# Altium project DIOT_Template.PrjPCB (part 2 of 3)

## Sheet DIOT_signal_routing.SchDoc: =DocumentName
size A4; DocumentNumber: 1; Revision: 0; SheetNumber: 9; SheetTotal: 18
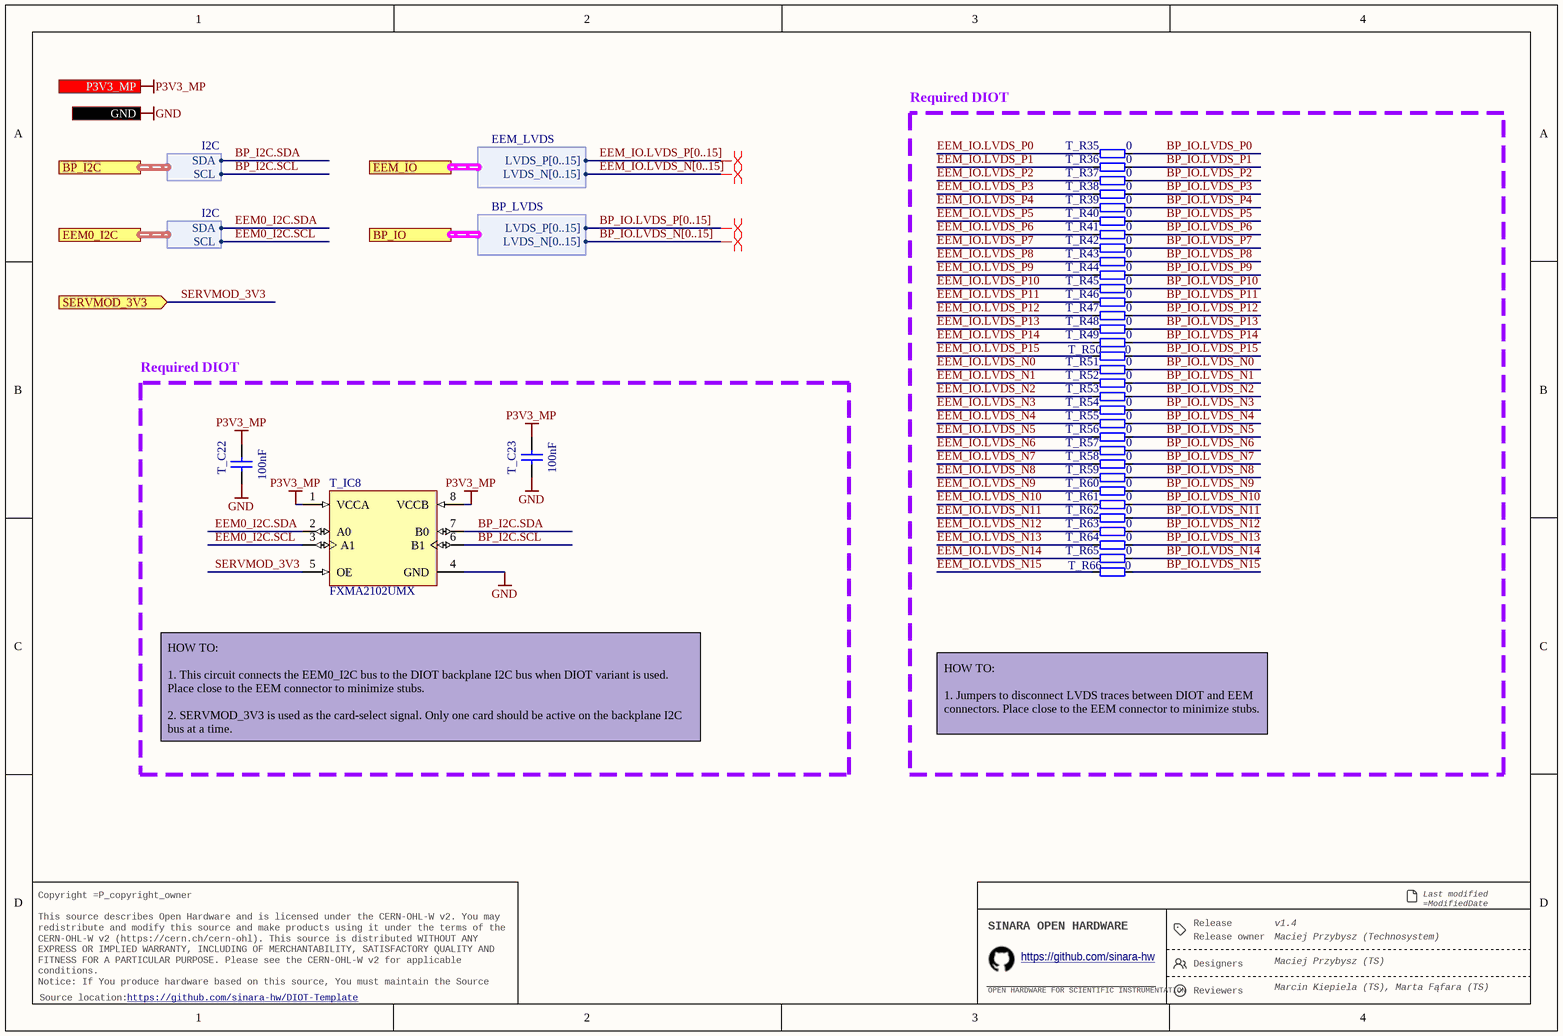
[diagram p6: DIOT_signal_routing.SchDoc]

### Parts
T_C22  100nF  [CAPC1005X55N]
T_C23  100nF  [CAPC1005X55N]
T_IC8  FXMA2102UMX  [FXMA2102UMX]
T_R35  0  [RESC1005X40N]
T_R36  0  [RESC1005X40N]
T_R37  0  [RESC1005X40N]
T_R38  0  [RESC1005X40N]
T_R39  0  [RESC1005X40N]
T_R40  0  [RESC1005X40N]
T_R41  0  [RESC1005X40N]
T_R42  0  [RESC1005X40N]
T_R43  0  [RESC1005X40N]
T_R44  0  [RESC1005X40N]
T_R45  0  [RESC1005X40N]
T_R46  0  [RESC1005X40N]
T_R47  0  [RESC1005X40N]
T_R48  0  [RESC1005X40N]
T_R49  0  [RESC1005X40N]
T_R50  0  [RESC1005X40N]
T_R51  0  [RESC1005X40N]
T_R52  0  [RESC1005X40N]
T_R53  0  [RESC1005X40N]
T_R54  0  [RESC1005X40N]
T_R55  0  [RESC1005X40N]
T_R56  0  [RESC1005X40N]
T_R57  0  [RESC1005X40N]
T_R58  0  [RESC1005X40N]
T_R59  0  [RESC1005X40N]
T_R60  0  [RESC1005X40N]
T_R61  0  [RESC1005X40N]
T_R62  0  [RESC1005X40N]
T_R63  0  [RESC1005X40N]
T_R64  0  [RESC1005X40N]
T_R65  0  [RESC1005X40N]
T_R66  0  [RESC1005X40N]

### Blocks framed on the sheet
Required DIOT: T_R35-T_R66
Required DIOT: T_C22 T_C23 T_IC8

### Ports
BP_I2C (harness I2C), BP_IO (harness BP_LVDS), EEM0_I2C (harness I2C), EEM_IO (harness EEM_LVDS), GND, P3V3_MP (in), SERVMOD_3V3 (in)

### Harnesses
I2C: SDA, SCL
EEM_LVDS: LVDS_P[0..15], LVDS_N[0..15]
BP_LVDS: LVDS_P[0..15], LVDS_N[0..15]

### Nets
GND: T_C22.1 T_C23.1 T_IC8.4(GND) ; port GND
P3V3_MP: T_C22.2 T_C23.2 T_IC8.1(VCCA) T_IC8.8(VCCB) ; port P3V3_MP
BP_I2C.SCL: T_IC8.6(B1) ; port BP_I2C.SCL
BP_I2C.SDA: T_IC8.7(B0) ; port BP_I2C.SDA
BP_IO.LVDS_N0: T_R51.1
BP_IO.LVDS_N1: T_R52.1
BP_IO.LVDS_N2: T_R53.1
BP_IO.LVDS_N3: T_R54.1
BP_IO.LVDS_N4: T_R55.1
BP_IO.LVDS_N5: T_R56.1
BP_IO.LVDS_N6: T_R57.1
BP_IO.LVDS_N7: T_R58.1
BP_IO.LVDS_N8: T_R59.1
BP_IO.LVDS_N9: T_R60.1
BP_IO.LVDS_N10: T_R61.1
BP_IO.LVDS_N11: T_R62.1
BP_IO.LVDS_N12: T_R63.1
BP_IO.LVDS_N13: T_R64.1
BP_IO.LVDS_N14: T_R65.1
BP_IO.LVDS_N15: T_R66.2
BP_IO.LVDS_P0: T_R35.1
BP_IO.LVDS_P1: T_R36.1
BP_IO.LVDS_P2: T_R37.1
BP_IO.LVDS_P3: T_R38.1
BP_IO.LVDS_P4: T_R39.1
BP_IO.LVDS_P5: T_R40.1
BP_IO.LVDS_P6: T_R41.1
BP_IO.LVDS_P7: T_R42.1
BP_IO.LVDS_P8: T_R43.1
BP_IO.LVDS_P9: T_R44.1
BP_IO.LVDS_P10: T_R45.1
BP_IO.LVDS_P11: T_R46.1
BP_IO.LVDS_P12: T_R47.1
BP_IO.LVDS_P13: T_R48.1
BP_IO.LVDS_P14: T_R49.1
BP_IO.LVDS_P15: T_R50.2
EEM0_I2C.SCL: T_IC8.3(A1) ; port EEM0_I2C.SCL
EEM0_I2C.SDA: T_IC8.2(A0) ; port EEM0_I2C.SDA
EEM_IO.LVDS_N0: T_R51.2
EEM_IO.LVDS_N1: T_R52.2
EEM_IO.LVDS_N2: T_R53.2
EEM_IO.LVDS_N3: T_R54.2
EEM_IO.LVDS_N4: T_R55.2
EEM_IO.LVDS_N5: T_R56.2
EEM_IO.LVDS_N6: T_R57.2
EEM_IO.LVDS_N7: T_R58.2
EEM_IO.LVDS_N8: T_R59.2
EEM_IO.LVDS_N9: T_R60.2
EEM_IO.LVDS_N10: T_R61.2
EEM_IO.LVDS_N11: T_R62.2
EEM_IO.LVDS_N12: T_R63.2
EEM_IO.LVDS_N13: T_R64.2
EEM_IO.LVDS_N14: T_R65.2
EEM_IO.LVDS_N15: T_R66.1
EEM_IO.LVDS_P0: T_R35.2
EEM_IO.LVDS_P1: T_R36.2
EEM_IO.LVDS_P2: T_R37.2
EEM_IO.LVDS_P3: T_R38.2
EEM_IO.LVDS_P4: T_R39.2
EEM_IO.LVDS_P5: T_R40.2
EEM_IO.LVDS_P6: T_R41.2
EEM_IO.LVDS_P7: T_R42.2
EEM_IO.LVDS_P8: T_R43.2
EEM_IO.LVDS_P9: T_R44.2
EEM_IO.LVDS_P10: T_R45.2
EEM_IO.LVDS_P11: T_R46.2
EEM_IO.LVDS_P12: T_R47.2
EEM_IO.LVDS_P13: T_R48.2
EEM_IO.LVDS_P14: T_R49.2
EEM_IO.LVDS_P15: T_R50.1
SERVMOD_3V3: T_IC8.5(OE) ; port SERVMOD_3V3

### Buses and harness runs
bus BP_IO.LVDS_N[0..15]
bus BP_IO.LVDS_P[0..15]
bus EEM_IO.LVDS_N[0..15]
bus EEM_IO.LVDS_P[0..15]

### Layout directives
differential pair; differential pair class Diff_100Ohm: (no net found under the mark)
differential pair: (no net found under the mark)

### Notes on the sheet
- HOW TO:
  1. This circuit connects the EEM0_I2C bus to the DIOT backplane I2C bus when DIOT variant is used. Place close to the EEM connector to minimize stubs.
  2. SERVMOD_3V3 is used as the card-select signal. Only one card should be active on the backplane I2C bus at a time.
- HOW TO:
  1. Jumpers to disconnect LVDS traces between DIOT and EEM connectors. Place close to the EEM connector to minimize stubs.
- Release
- Last modified =ModifiedDate
  Sheet =sheetnumber of =sheettotal · Size A4
- Copyright =P_copyright_owner
  This source describes Open Hardware and is licensed under the CERN-OHL-W v2. You may redistribute and modify this source and make products using it under the terms of the CERN-OHL-W v2 (https://cern.ch/cern-ohl). This source is distributed WITHOUT ANY EXPRESS OR IMPLIED WARRANTY, INCLUDING OF MERCHANTABILITY, SATISFACTORY QUALITY AND FITNESS FOR A PARTICULAR PURPOSE. Please see the CERN-OHL-W v2 for applicable conditions.
  Notice: If You produce hardware based on this source, You must maintain the Source Location visible on the product, its packaging or its documentation.
- SINARA OPEN HARDWARE
- OPEN HARDWARE FOR SCIENTIFIC INSTRUMENTATION
- https://github.com/sinara-hw
- Release owner
- Designers
- Reviewers
- Source location:

### Library data of the parts
T_C22 T_C23 = CC0402_100NF_50V_10%_X7R: as T_C14 on sheet Power-up_delay; Part Number: CC0402_100NF_50V_10%_X7R; Component Kind: Standard; Component Type: Standard; Pin Count: 2; Value: 100nF; Status: None; Manufacturer Part Number: CC0402_100NF_50V_10%_X7R; Case: 0402; Mounted: Yes; Socket: No; SMD: Yes; Manufacturer1 Example: MURATA; Manufacturer1 ComponentHeight: 0.55mm; HelpURL: \\cern.ch\dfs\Applications\Altium\Datasheets\CC0402_MURATA_GRM155R71H104KE14D.pdf; Author: CERN DEM MR; CreateDate: 30.06.2017; LatestRevisionDate: 30.06.2017; Sense: No
T_IC8 = CMP-015-00014-1: Dual Supply 2-Bit Voltage Translator/Buffer/Repeater Isolator for I2C Applications; Manufacturer: Onsemi; Max Supply Voltage: 5.5V; Min Supply Voltage: 1.65V; Min Operating Temperature: -40°C; Pins: 8; Max Operating Temperature: 85°C; Manufacaturer Part Number: FXMA2102UMX; Mounting Technology: Surface Mount
T_R35-T_R66 = R0402_0R_JUMPER: Resistor; Part Description: 1A (0.05R Max DC Resistance) Zero Ohm Jumper; Manufacturer: GENERIC; Manufacturer1 Part Number: 232270591001L; PressFit: No; Part Number: R0402_0R_JUMPER; Component Kind: Standard; Component Type: Standard; Pin Count: 2; Value: 0; Status: Not Recommended; Manufacturer Part Number: R0402_0R_JUMPER; Case: 0402; Mounted: Yes; Sense: No; Socket: No; SMD: Yes; Manufacturer1 Example: YAGEO PHYCOMP; Manufacturer1 ComponentHeight: 0.4mm; HelpURL: \\cern.ch\dfs\Applications\Altium\Datasheets\R0402_Phycomp_RC0402.pdf; Author: CERN DEM JLC; CreateDate: 03.12.2007; LatestRevisionDate: 17.10.2012

## Sheet EEM_Connectors.SchDoc: =DocumentName
size A4; SPICEModelCacheVGBTAUBO: <root> / <DocumentId>VGBTAUBO</DocumentId> / </root>; DocumentNumber: 1; Revision: 0; SheetNumber: 6; SheetTotal: 18
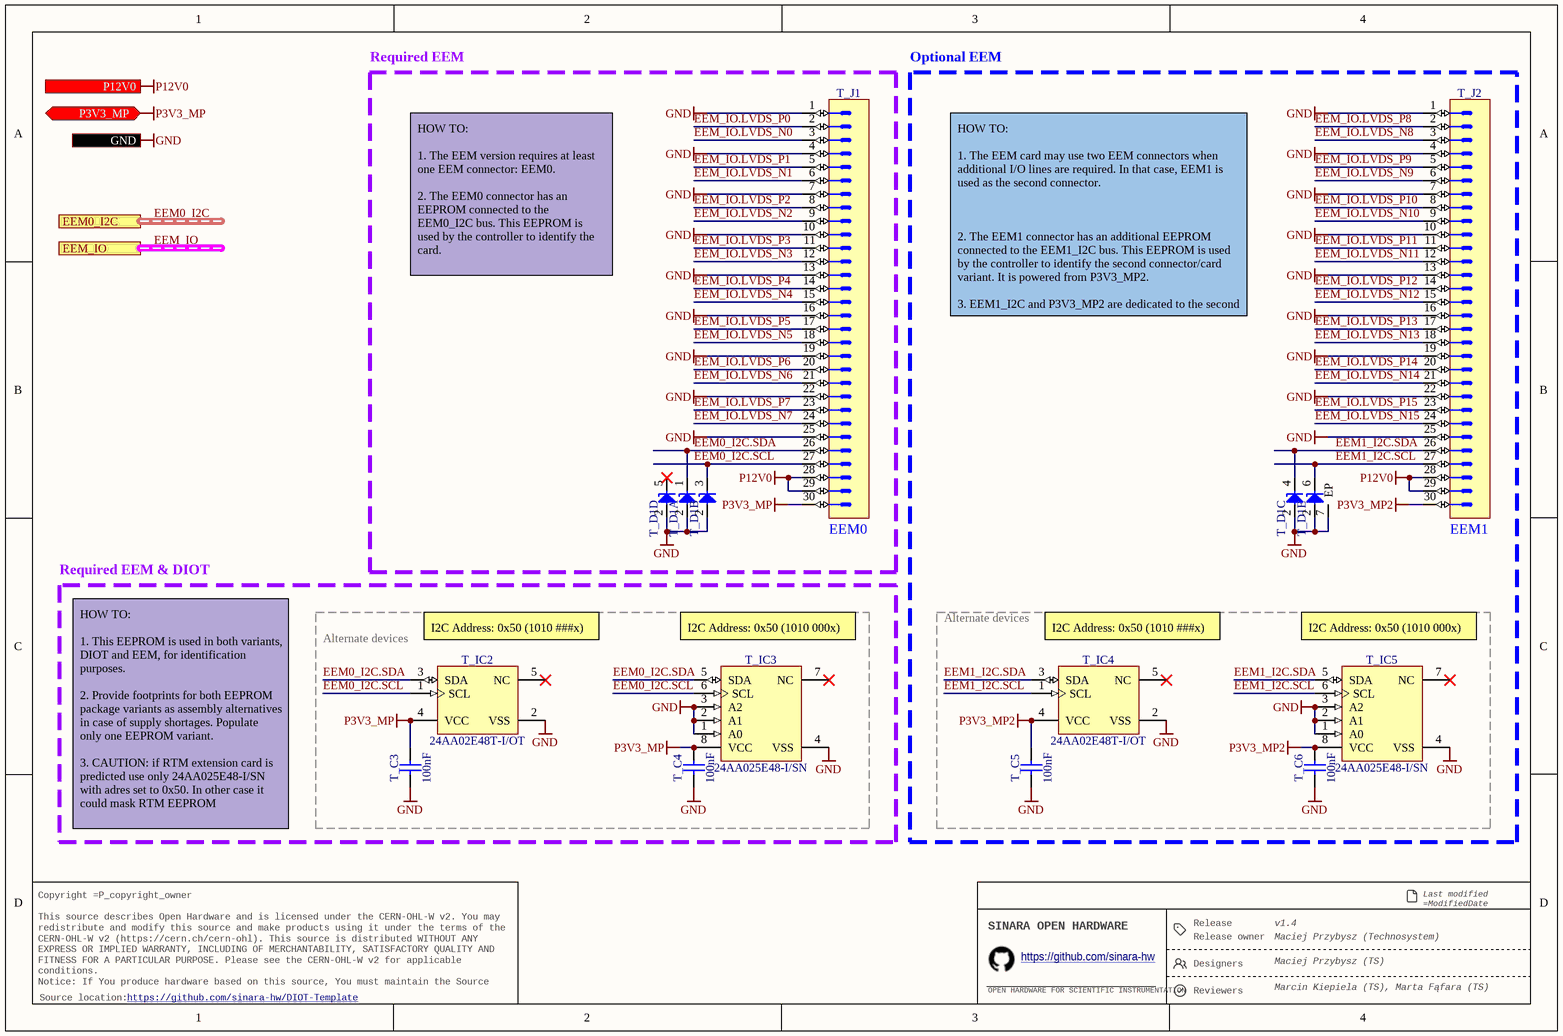
[diagram p7: EEM_Connectors.SchDoc]

### Parts
T_C3  100nF  [CAPC1005X55N]
T_C4  100nF  [CAPC1005X55N]
T_C5  100nF  [CAPC1005X55N]
T_C6  100nF  [CAPC1005X55N]
T_D1  UCLAMP3305P.TCT  [SON50P160X65_HS-7N]  (value not drawn)  (parts A,B,C,D,E of 5)
T_IC2  24AA02E48T-I/OT  [SOT95P280X145-5N]
T_IC3  24AA025E48-I/SN  [SOIC127P600X175-8N]
T_IC4  24AA02E48T-I/OT  [SOT95P280X145-5N]
T_IC5  24AA025E48-I/SN  [SOIC127P600X175-8N]
T_J1  (no value)  [3M_N2530-6002RB]
T_J2  (no value)  [3M_N2530-6002RB]

### Blocks framed on the sheet
Alternate devices: T_C3 T_C4 T_IC2 T_IC3
Alternate devices: T_C5 T_C6 T_IC4 T_IC5

### Ports
EEM0_I2C (harness I2C), EEM_IO (harness EEM_LVDS), GND, P3V3_MP (bidir), P12V0 (out)

### Nets
GND: T_C3.1 T_C4.1 T_C5.1 T_C6.1 T_D1.2(A) T_D1.7(EP) T_IC2.2(VSS) T_IC3.1(A0) T_IC3.2(A1) T_IC3.3(A2) T_IC3.4(VSS) T_IC4.2(VSS) T_IC5.1(A0) T_IC5.2(A1) T_IC5.3(A2) T_IC5.4(VSS) T_J1.1 T_J1.4 T_J1.7 T_J1.10 T_J1.13 T_J1.16 T_J1.19 T_J1.22 T_J1.25 T_J2.1 T_J2.4 T_J2.7 T_J2.10 T_J2.13 T_J2.16 T_J2.19 T_J2.22 T_J2.25 ; port GND
P3V3_MP: T_C3.2 T_C4.2 T_IC2.4(VCC) T_IC3.8(VCC) T_J1.30 ; port P3V3_MP
P3V3_MP2: T_C5.2 T_C6.2 T_IC4.4(VCC) T_IC5.8(VCC) T_J2.30
P12V0: T_J1.28 T_J1.29 T_J2.28 T_J2.29 ; port P12V0
EEM0_I2C.SCL: T_D1.3(C) T_IC2.1(SCL) T_IC3.6(SCL) T_J1.27
EEM0_I2C.SDA: T_D1.1(C) T_IC2.3(SDA) T_IC3.5(SDA) T_J1.26
EEM1_I2C.SCL: T_D1.6(C) T_IC4.1(SCL) T_IC5.6(SCL) T_J2.27
EEM1_I2C.SDA: T_D1.4(C) T_IC4.3(SDA) T_IC5.5(SDA) T_J2.26
EEM_IO.LVDS_N0: T_J1.3
EEM_IO.LVDS_N1: T_J1.6
EEM_IO.LVDS_N2: T_J1.9
EEM_IO.LVDS_N3: T_J1.12
EEM_IO.LVDS_N4: T_J1.15
EEM_IO.LVDS_N5: T_J1.18
EEM_IO.LVDS_N6: T_J1.21
EEM_IO.LVDS_N7: T_J1.24
EEM_IO.LVDS_N8: T_J2.3
EEM_IO.LVDS_N9: T_J2.6
EEM_IO.LVDS_N10: T_J2.9
EEM_IO.LVDS_N11: T_J2.12
EEM_IO.LVDS_N12: T_J2.15
EEM_IO.LVDS_N13: T_J2.18
EEM_IO.LVDS_N14: T_J2.21
EEM_IO.LVDS_N15: T_J2.24
EEM_IO.LVDS_P0: T_J1.2
EEM_IO.LVDS_P1: T_J1.5
EEM_IO.LVDS_P2: T_J1.8
EEM_IO.LVDS_P3: T_J1.11
EEM_IO.LVDS_P4: T_J1.14
EEM_IO.LVDS_P5: T_J1.17
EEM_IO.LVDS_P6: T_J1.20
EEM_IO.LVDS_P7: T_J1.23
EEM_IO.LVDS_P8: T_J2.2
EEM_IO.LVDS_P9: T_J2.5
EEM_IO.LVDS_P10: T_J2.8
EEM_IO.LVDS_P11: T_J2.11
EEM_IO.LVDS_P12: T_J2.14
EEM_IO.LVDS_P13: T_J2.17
EEM_IO.LVDS_P14: T_J2.20
EEM_IO.LVDS_P15: T_J2.23

Not connected (* = marked no-connect by the designer): T_D1 5(C)*; T_IC2 5(NC)*; T_IC3 7(NC)*; T_IC4 5(NC)*; T_IC5 7(NC)*

### Buses and harness runs
harness EEM0_I2C = port EEM0_I2C
harness EEM_IO = port EEM_IO

### Notes on the sheet
- Required EEM
- Optional EEM
- HOW TO:
  1. The EEM version requires at least one EEM connector: EEM0.
  2. The EEM0 connector has an EEPROM connected to the EEM0_I2C bus. This EEPROM is used by the controller to identify the card.
- HOW TO:
  1. The EEM card may use two EEM connectors when additional I/O lines are required. In that case, EEM1 is used as the second connector.
  2. The EEM1 connector has an additional EEPROM connected to the EEM1_I2C bus. This EEPROM is used by the controller to identify the second connector/card variant. It is powered from P3V3_MP2.
  3. EEM1_I2C and P3V3_MP2 are dedicated to the second EEPROM only. Do not use them for any other purpose.
- Required EEM & DIOT
- (near T_J1) EEM0
- (near T_J2) EEM1
- (near T_IC2) I2C Address: 0x50 (1010 ###x)
- (near T_IC3) I2C Address: 0x50 (1010 000x)
- (near T_IC4) I2C Address: 0x50 (1010 ###x)
- (near T_IC5) I2C Address: 0x50 (1010 000x)
- HOW TO:
  1. This EEPROM is used in both variants, DIOT and EEM, for identification purposes.
  2. Provide footprints for both EEPROM package variants as assembly alternatives in case of supply shortages. Populate only one EEPROM variant.
  3. CAUTION: if RTM extension card is predicted use only 24AA025E48-I/SN with adres set to 0x50. In other case it could mask RTM EEPROM
- Release
- Last modified =ModifiedDate
  Sheet =sheetnumber of =sheettotal · Size A4
- Copyright =P_copyright_owner
  This source describes Open Hardware and is licensed under the CERN-OHL-W v2. You may redistribute and modify this source and make products using it under the terms of the CERN-OHL-W v2 (https://cern.ch/cern-ohl). This source is distributed WITHOUT ANY EXPRESS OR IMPLIED WARRANTY, INCLUDING OF MERCHANTABILITY, SATISFACTORY QUALITY AND FITNESS FOR A PARTICULAR PURPOSE. Please see the CERN-OHL-W v2 for applicable conditions.
  Notice: If You produce hardware based on this source, You must maintain the Source Location visible on the product, its packaging or its documentation.
- SINARA OPEN HARDWARE
- OPEN HARDWARE FOR SCIENTIFIC INSTRUMENTATION
- https://github.com/sinara-hw
- Release owner
- Designers
- Reviewers
- Source location:

### Library data of the parts
T_C3-T_C6 = CC0402_100NF_50V_10%_X7R: as T_C14 on sheet Power-up_delay; Part Number: CC0402_100NF_50V_10%_X7R; Component Kind: Standard; Component Type: Standard; Pin Count: 2; Value: 100nF; Status: None; Manufacturer Part Number: CC0402_100NF_50V_10%_X7R; Case: 0402; Mounted: Yes; Socket: No; SMD: Yes; Sense: No; HelpURL: \\cern.ch\dfs\Applications\Altium\Datasheets\CC0402_MURATA_GRM155R71H104KE14D.pdf; Author: CERN DEM MR; CreateDate: 30.06.2017; LatestRevisionDate: 30.06.2017; Manufacturer1 Example: MURATA; Manufacturer1 ComponentHeight: 0.55mm
T_D1 = CMP-004-00037-2: Diode TVS Quint Common Anode Uni-Dir 3.3V 40W 6-Pin SLP EP T/R; Max Operating Temperature: 125°C; Min Operating Temperature: -55°C; Pins: 6; Mounting Technology: Surface Mount
T_IC2 T_IC4 = 24AA02E48T-I/OT: 1.7V-5.5V, 2K I2C Serial EEPROM With EUI-48 Node Identity; Manufacturer: MICROCHIP TECHNOLOGY; PressFit: No; Bonding: No; Part Number: 24AA02E48T-I/OT; Component Kind: Standard; Component Type: Standard; Device: 24AA02E48T-I/OT; PackageDescription: SOT, 0.95mm pitch; 5 pin, 1.60mm W X 2.90mm L X 1.45mm H body, IPC Medium Density; Part Description: 1.7V-5.5V, 2K I2C Serial EEPROM with EUI-48 Node Identity; Manufacturer Part Number: 24AA02E48T-I/OT; Pin Count: 5; Case: SOT23-5; Mounted: Yes; Socket: No; SMD: Yes; Sense: No; ComponentHeight: 1.45mm; HelpURL: \\cern.ch\dfs\Applications\Altium\Datasheets\24AA02E48T-I-OT.pdf; Author: CERN DEM MR; CreateDate: 31.03.2016; LatestRevisionDate: 31.03.2016
T_IC3 T_IC5 = 24AA025E48-I/SN: 1.7V-5.5V, 2K I2C™ Serial EEPROMs with EUI-48™ Node Identity; Manufacturer: MICROCHIP TECHNOLOGY; PressFit: No; Bonding: No; Part Number: 24AA025E48-I/SN; Component Kind: Standard; Component Type: Standard; Device: 24AA025E48-I/SN; PackageDescription: SOIC 8, Pitch 1.27mm - Body 4x5mm, IPC Medium Density; Part Description: 1.7V-5.5V, 2K I2C™ Serial EEPROMs with EUI-48™ Node Identity; Manufacturer Part Number: 24AA025E48-I/SN; Pin Count: 8; Case: SOIC8; Mounted: Yes; Socket: No; SMD: Yes; Sense: No; ComponentHeight: 1.75mm; HelpURL: \\cern.ch\dfs\Applications\Altium\Datasheets\24AA025E48-I-SN.pdf; Author: CERN DEM MR; CreateDate: 19.07.2016; LatestRevisionDate: 19.07.2016
T_J1 T_J2 = 3M_N2530-6002RB: Connector 30 Male; Part Description: 30 Contacts - Straight .100'' x .100'' Low Profile Four-Wall Header, 2500 Series; Manufacturer: 3M; PressFit: No; Part Number: 3M_N2530-6002RB; Component Kind: Standard; Component Type: Standard; Pin Count: 30; Family: Header 30; Mounted: Yes; Socket: No; SMD: No; Sense: No; Status: None; Manufacturer Part Number: N2530-6002RB; ComponentHeight: 10.03mm; HelpURL: \\cern.ch\dfs\Applications\Altium\Datasheets\3M_N2530-6002RB.pdf; Author: CERN DEM JLC; CreateDate: 11.02.2009; LatestRevisionDate: 11.08.2009

## Sheet CLK_GEN.SchDoc: =DocumentName
size A4; DocumentNumber: 1; Revision: 0; SheetNumber: 7; SheetTotal: 18
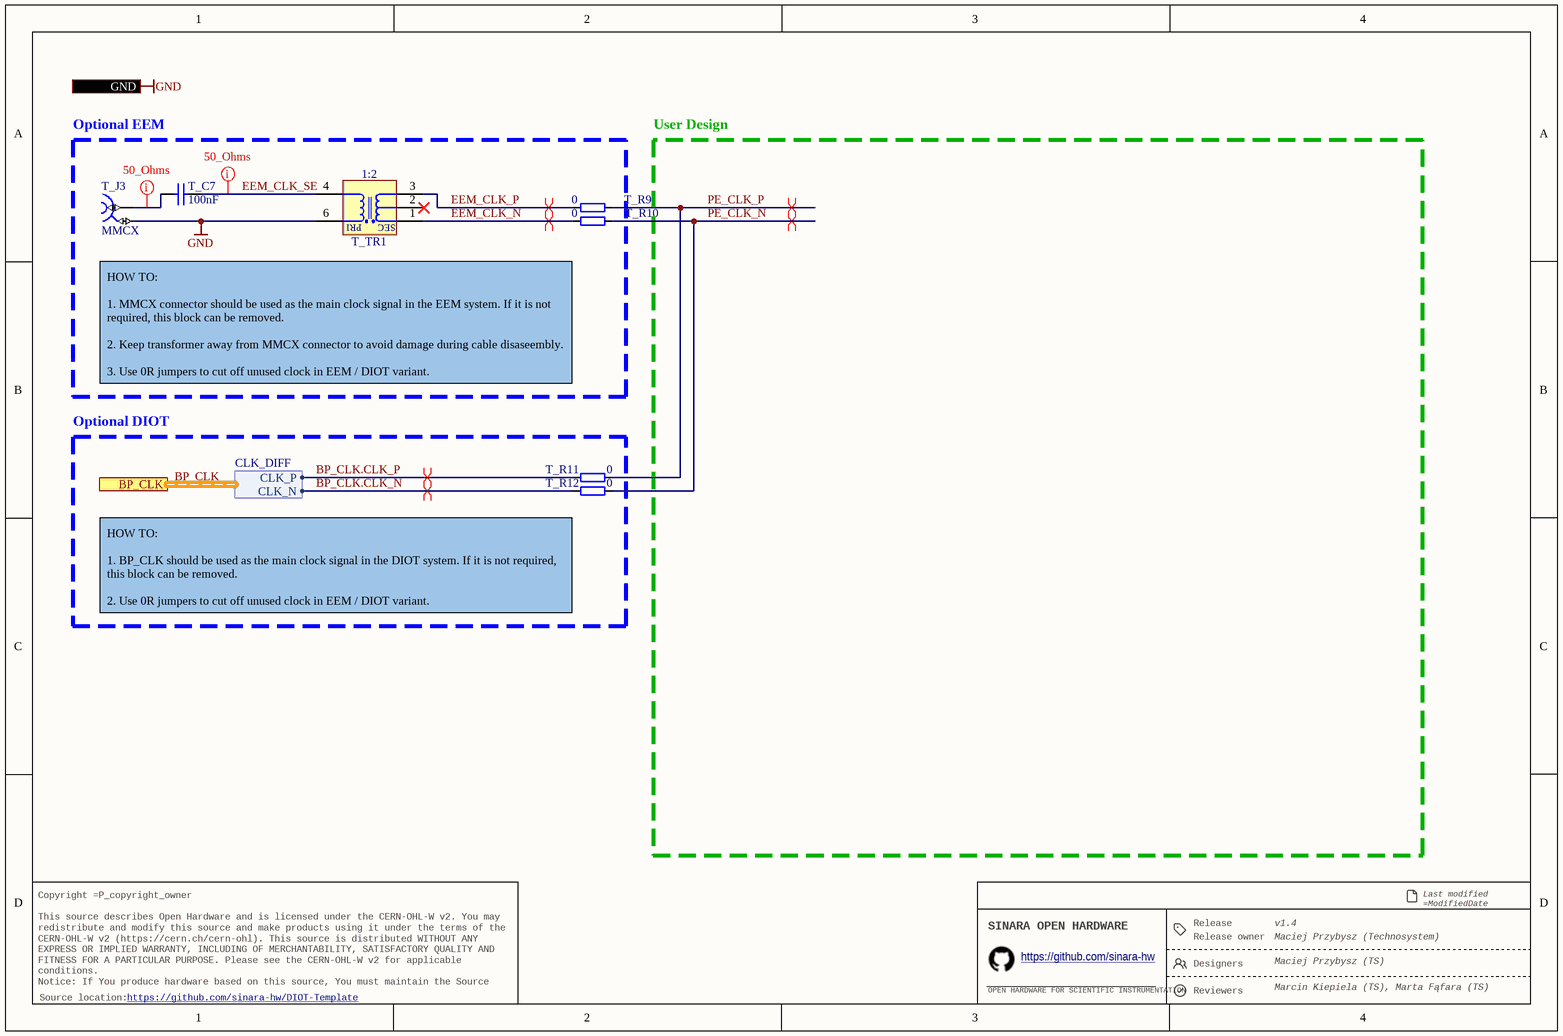
[diagram p8: CLK_GEN.SchDoc]

### Parts
T_C7  100nF  [CAPC1005X55N]
T_J3  MMCX  [SAMTEC_MMCX-J-P-H-ST-TH1]
T_R9  0  [RESC1005X40N]
T_R10  0  [RESC1005X40N]
T_R11  0  [RESC1005X40N]
T_R12  0  [RESC1005X40N]
T_TR1  1:2  [XFMR_MINI-CIRCUITS_DB714]

### Blocks framed on the sheet
Optional EEM: T_C7 T_J3 T_R9 T_R10 T_TR1
Optional DIOT: T_R11 T_R12

### Ports
BP_CLK (harness CLK_DIFF), GND

### Harnesses
CLK_DIFF: CLK_N, CLK_P

### Nets
GND: T_J3.2 T_TR1.6(PDOT) ; port GND
BP_CLK.CLK_N: T_R12.1 ; port BP_CLK.CLK_N
BP_CLK.CLK_P: T_R11.1 ; port BP_CLK.CLK_P
EEM_CLK_N: T_R10.2 T_TR1.1(SDOT)
EEM_CLK_P: T_R9.2 T_TR1.3(S)
EEM_CLK_SE: T_C7.1 T_TR1.4(P)
PE_CLK_N: T_R10.1 T_R12.2
PE_CLK_P: T_R9.1 T_R11.2
NetT_C7_2: T_C7.2 T_J3.1

Not connected (* = marked no-connect by the designer): T_TR1 2(NU)*

### Buses and harness runs
harness BP_CLK = port BP_CLK

### Layout directives
differential pair; differential pair class Diff_100Ohm: PE_CLK_N, PE_CLK_P
net class 50Ohm: EEM_CLK_SE, NetT_C7_2
differential pair: BP_CLK.CLK_N, BP_CLK.CLK_P, EEM_CLK_N, EEM_CLK_P

### Notes on the sheet
- User Design
- HOW TO:
  1. MMCX connector should be used as the main clock signal in the EEM system. If it is not required, this block can be removed.
  2. Keep transformer away from MMCX connector to avoid damage during cable disaseembly.
  3. Use 0R jumpers to cut off unused clock in EEM / DIOT variant.
- HOW TO:
  1. BP_CLK should be used as the main clock signal in the DIOT system. If it is not required, this block can be removed.
  2. Use 0R jumpers to cut off unused clock in EEM / DIOT variant.
- Release
- Last modified =ModifiedDate
  Sheet =sheetnumber of =sheettotal · Size A4
- Copyright =P_copyright_owner
  This source describes Open Hardware and is licensed under the CERN-OHL-W v2. You may redistribute and modify this source and make products using it under the terms of the CERN-OHL-W v2 (https://cern.ch/cern-ohl). This source is distributed WITHOUT ANY EXPRESS OR IMPLIED WARRANTY, INCLUDING OF MERCHANTABILITY, SATISFACTORY QUALITY AND FITNESS FOR A PARTICULAR PURPOSE. Please see the CERN-OHL-W v2 for applicable conditions.
  Notice: If You produce hardware based on this source, You must maintain the Source Location visible on the product, its packaging or its documentation.
- SINARA OPEN HARDWARE
- OPEN HARDWARE FOR SCIENTIFIC INSTRUMENTATION
- https://github.com/sinara-hw
- Release owner
- Designers
- Reviewers
- Source location:

### Library data of the parts
T_C7 = CC0402_100NF_50V_10%_X7R: as T_C14 on sheet Power-up_delay; Part Number: CC0402_100NF_50V_10%_X7R; Component Kind: Standard; Component Type: Standard; Pin Count: 2; Value: 100nF; Status: None; Manufacturer Part Number: CC0402_100NF_50V_10%_X7R; Case: 0402; Mounted: Yes; Socket: No; SMD: Yes; Sense: No; Manufacturer1 Example: MURATA; Manufacturer1 ComponentHeight: 0.55mm; HelpURL: \\cern.ch\dfs\Applications\Altium\Datasheets\CC0402_MURATA_GRM155R71H104KE14D.pdf; Author: CERN DEM MR; CreateDate: 30.06.2017; LatestRevisionDate: 30.06.2017
T_J3 = SAMTEC_MMCX-J-P-H-ST-TH1: Part Description: Straight Through-hole 50 Ohm Micro Mini RF Jack, MMCX Series; Manufacturer: SAMTEC; PressFit: No; Part Number: SAMTEC_MMCX-J-P-H-ST-TH1; Component Kind: Standard; Component Type: Standard; Pin Count: 2; Mounted: Yes; Socket: No; Sense: No; SMD: No; Status: None; Manufacturer Part Number: MMCX-J-P-H-ST-TH1; ComponentHeight: 4.35mm; HelpURL: \\cern.ch\dfs\Applications\Altium\Datasheets\SAMTEC_MMCX-J-P-H-ST-TH1.pdf; Author: CERN DEM JLC; CreateDate: 05.12.2012; LatestRevisionDate: 05.12.2012
T_R9-T_R12 = R0402_0R_JUMPER: as T_R35 on sheet DIOT_signal_routing; Part Number: R0402_0R_JUMPER; Component Kind: Standard; Component Type: Standard; Pin Count: 2; Value: 0; Status: Not Recommended; Manufacturer Part Number: R0402_0R_JUMPER; Case: 0402; Mounted: Yes; Sense: No; Socket: No; SMD: Yes; Manufacturer1 Example: YAGEO PHYCOMP; Manufacturer1 ComponentHeight: 0.4mm; HelpURL: \\cern.ch\dfs\Applications\Altium\Datasheets\R0402_Phycomp_RC0402.pdf; Author: CERN DEM JLC; CreateDate: 03.12.2007; LatestRevisionDate: 17.10.2012
T_TR1 = XFMR_MINI-CIRCUITS_TCM2-1T: 50 Ohms 3 to 300MHz RF Transformer; Power: 0.25W; Part Number: XFMR_MINI-CIRCUITS_TCM2-1T; Component Kind: Standard; Component Type: Standard; Pin Count: 6; Value: 1:2; Status: None; Part Description: 50 Ohms 3 to 300MHz RF Transformer; Manufacturer: MINI-CIRCUITS; Manufacturer Part Number: TCM2-1T; Mounted: Yes; Socket: No; Sense: No; SMD: Yes; ComponentHeight: 4.06mm; HelpURL: \\cern.ch\dfs\Applications\Altium\Datasheets\XFMR_MINI-CIRCUITS_TCM2-1T.pdf; Author: CERN DEM HF; CreateDate: 30.05.2023; LatestRevisionDate: 30.05.2023

## Sheet Temperature_monitoring.SchDoc: =DocumentName
size A4; DocumentNumber: 1; Revision: 0; SheetNumber: 10; SheetTotal: 18
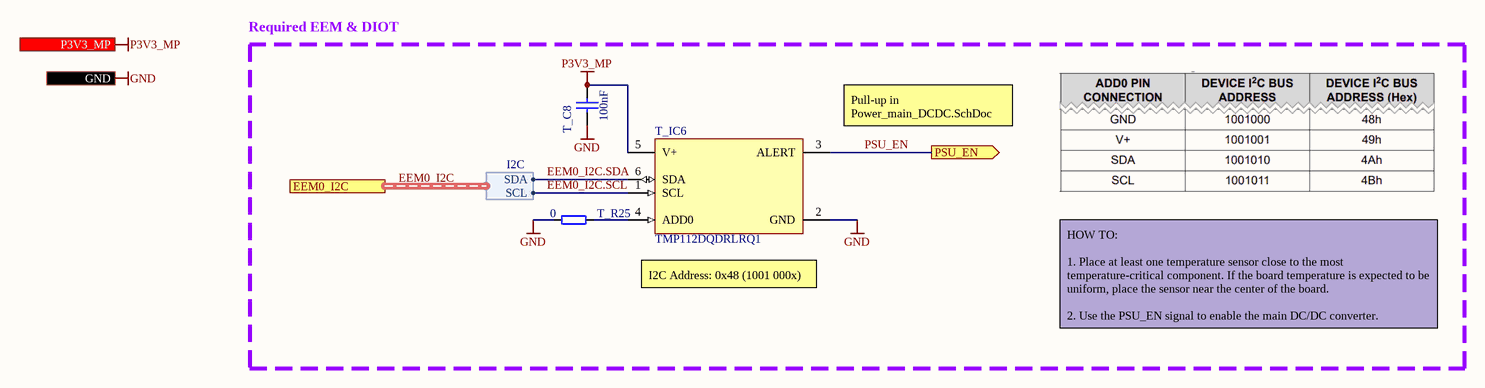
[diagram p9: Temperature_monitoring.SchDoc]

### Parts
T_C8  100nF  [CAPC1005X55N]
T_IC6  TMP112DQDRLRQ1  [SOTFL50P160X60-6N]
T_R25  0  [RESC1005X40N]

### Blocks framed on the sheet
Required EEM & DIOT: T_C8 T_IC6 T_R25

### Ports
EEM0_I2C (harness I2C), GND, P3V3_MP (in), PSU_EN (out)

### Harnesses
I2C: SDA, SCL

### Nets
GND: T_C8.1 T_IC6.2(GND) T_R25.1 ; port GND
P3V3_MP: T_C8.2 T_IC6.5(V+) ; port P3V3_MP
EEM0_I2C.SCL: T_IC6.1(SCL) ; port EEM0_I2C.SCL
EEM0_I2C.SDA: T_IC6.6(SDA) ; port EEM0_I2C.SDA
PSU_EN: T_IC6.3(ALERT) ; port PSU_EN
NetT_IC6_4: T_IC6.4(ADD0) T_R25.2

### Buses and harness runs
harness EEM0_I2C = port EEM0_I2C

### Notes on the sheet
- (near T_IC6) Pull-up in Power_main_DCDC.SchDoc
- (near T_IC6) I2C Address: 0x48 (1001 000x)
- HOW TO:
  1. Place at least one temperature sensor close to the most temperature-critical component. If the board temperature is expected to be uniform, place the sensor near the center of the board.
  2. Use the PSU_EN signal to enable the main DC/DC converter.
- Release
- Last modified =ModifiedDate
  Sheet =sheetnumber of =sheettotal · Size A4
- Copyright =P_copyright_owner
  This source describes Open Hardware and is licensed under the CERN-OHL-W v2. You may redistribute and modify this source and make products using it under the terms of the CERN-OHL-W v2 (https://cern.ch/cern-ohl). This source is distributed WITHOUT ANY EXPRESS OR IMPLIED WARRANTY, INCLUDING OF MERCHANTABILITY, SATISFACTORY QUALITY AND FITNESS FOR A PARTICULAR PURPOSE. Please see the CERN-OHL-W v2 for applicable conditions.
  Notice: If You produce hardware based on this source, You must maintain the Source Location visible on the product, its packaging or its documentation.
- SINARA OPEN HARDWARE
- OPEN HARDWARE FOR SCIENTIFIC INSTRUMENTATION
- https://github.com/sinara-hw
- Release owner
- Designers
- Reviewers
- Source location:

### Library data of the parts
T_C8 = CC0402_100NF_50V_10%_X7R: as T_C14 on sheet Power-up_delay; Part Number: CC0402_100NF_50V_10%_X7R; Component Kind: Standard; Component Type: Standard; Pin Count: 2; Value: 100nF; Status: None; Manufacturer Part Number: CC0402_100NF_50V_10%_X7R; Case: 0402; Mounted: Yes; Socket: No; SMD: Yes; Sense: No; Manufacturer1 Example: MURATA; Manufacturer1 ComponentHeight: 0.55mm; HelpURL: \\cern.ch\dfs\Applications\Altium\Datasheets\CC0402_MURATA_GRM155R71H104KE14D.pdf; Author: CERN DEM MR; CreateDate: 30.06.2017; LatestRevisionDate: 30.06.2017
T_IC6 = CMP-010-00651-1: Automotive, ±0.4°C accurate I²C temperature sensor with alert option 6-SOT-5X3 -40 to 125; Manufacturer: Texas Instruments; Pins: 6; Manufacturer Part Number: TMP112DQDRLRQ1
T_R25 = R0402_0R_JUMPER: Resistor; Part Description: 1A (0.05R Max DC Resistance) Zero Ohm Jumper; Manufacturer: GENERIC; Manufacturer1 Part Number: 232270591001L; Part Number: R0402_0R_JUMPER; Component Kind: Standard; Component Type: Standard; Pin Count: 2; Value: 0; Status: Not recommended; Manufacturer Part Number: R0402_0R_JUMPER; Case: 0402; Mounted: Yes; Sense: No; Socket: No; SMD: Yes; Manufacturer1 Example: YAGEO PHYCOMP; Manufacturer1 ComponentHeight: 0.4mm; HelpURL: \\cern.ch\dfs\Applications\Altium\Datasheets\R0402_Phycomp_RC0402.pdf; Author: CERN DEM JLC; CreateDate: 03.12.2007; LatestRevisionDate: 17.10.2012

## Sheet PWR_input_connector.SchDoc: =DocumentName
size A4; DocumentNumber: 1; Revision: 0; SheetNumber: 11; SheetTotal: 18
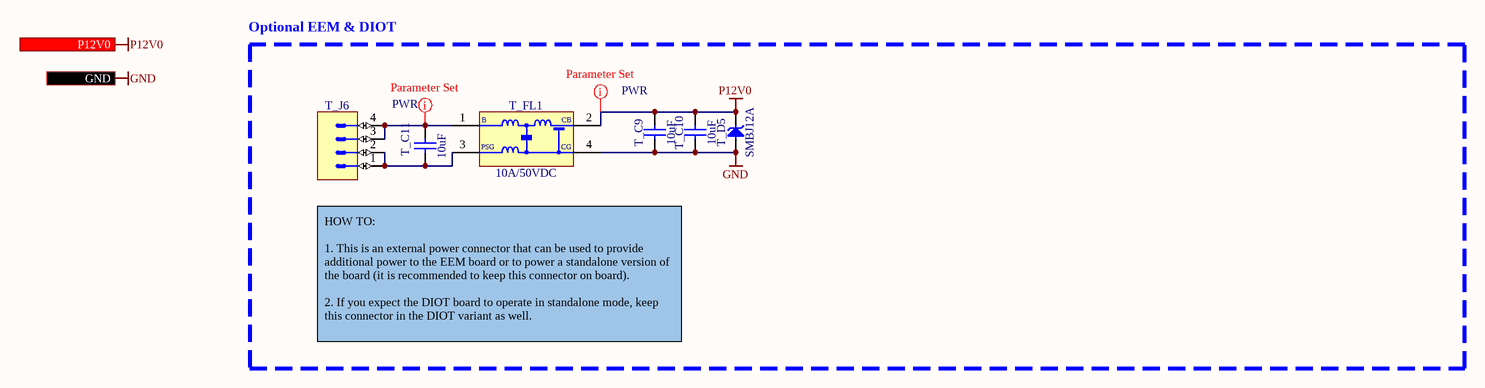
[diagram p10: PWR_input_connector.SchDoc]

### Parts
T_C9  10uF  [CAPC2012X95N]
T_C10  10uF  [CAPC2012X95N]
T_C11  10uF  [CAPC2012X95N]
T_D5  SMBJ12A  [DIOM5336X265N]
T_FL1  10A/50VDC  [FIL_MURATA_BNX02]
T_J6  Mini-Fit Jr.™  [MOLEX_39-30-0040]  (value not drawn)

### Blocks framed on the sheet
Optional EEM & DIOT: T_C9-T_C11 T_D5 T_FL1 T_J6

### Ports
GND, P12V0 (out)

### Nets
GND: T_C9.1 T_C10.1 T_D5.2(A) T_FL1.4(CG) ; port GND
P12V0: T_C9.2 T_C10.2 T_D5.1(C) T_FL1.2(CB) ; port P12V0
NetT_C11_1: T_C11.1 T_FL1.3(PSG) T_J6.1 T_J6.2
NetT_C11_2: T_C11.2 T_FL1.1(B) T_J6.3 T_J6.4

### Layout directives
net class PWR: NetT_C11_2, P12V0

### Notes on the sheet
- HOW TO:
  1. This is an external power connector that can be used to provide additional power to the EEM board or to power a standalone version of the board (it is recommended to keep this connector on board).
  2. If you expect the DIOT board to operate in standalone mode, keep this connector in the DIOT variant as well.
- Release
- Last modified =ModifiedDate
  Sheet =sheetnumber of =sheettotal · Size A4
- Copyright =P_copyright_owner
  This source describes Open Hardware and is licensed under the CERN-OHL-W v2. You may redistribute and modify this source and make products using it under the terms of the CERN-OHL-W v2 (https://cern.ch/cern-ohl). This source is distributed WITHOUT ANY EXPRESS OR IMPLIED WARRANTY, INCLUDING OF MERCHANTABILITY, SATISFACTORY QUALITY AND FITNESS FOR A PARTICULAR PURPOSE. Please see the CERN-OHL-W v2 for applicable conditions.
  Notice: If You produce hardware based on this source, You must maintain the Source Location visible on the product, its packaging or its documentation.
- SINARA OPEN HARDWARE
- OPEN HARDWARE FOR SCIENTIFIC INSTRUMENTATION
- https://github.com/sinara-hw
- Release owner
- Designers
- Reviewers
- Source location:

### Library data of the parts
T_C9-T_C11 = CC0805_10UF_25V_10%_X5R: Non-polarised capacitor; Part Description: SMD Multilayer Chip Ceramic Capacitor; Manufacturer: GENERIC; Manufacturer1 Part Number: GRM219R61E106KA12D; Voltage: 25V; TC: X5R; Tolerance: ±10%; Part Number: CC0805_10UF_25V_10%_X5R; Component Kind: Standard; Component Type: Standard; Pin Count: 2; Value: 10uF; Status: Preferred; Manufacturer Part Number: CC0805_10UF_25V_10%_X5R; Case: 0805; Mounted: Yes; Socket: No; SMD: Yes; Sense: No; Manufacturer1 Example: MURATA; Manufacturer1 ComponentHeight: 0.95mm; HelpURL: \\cern.ch\dfs\Applications\Altium\Datasheets\CC0805_X5R_MURATA_GRM.pdf; Author: CERN DEM JLC; CreateDate: 25.10.2012; LatestRevisionDate: 06.09.2016
T_D5 = SMBJ12A: Zener Diode; Part Description: Uni-Directional Transient Voltage Suppressor Diode; Manufacturer: FAIRCHILD SEMICONDUCTOR; Voltage: 12V; Power: 600W; PressFit: No; Bonding: No; Part Number: SMBJ12A; Component Kind: Standard; Component Type: Standard; Device: SMBJ12A; PackageDescription: DO-214-AA/SMB Diode, Molded Body; 5.34mm L X 3.625mm W X 2.65mm H, IPC Medium Density; Manufacturer Part Number: SMBJ12A; Pin Count: 2; Case: DO-214AA; Mounted: Yes; Socket: No; SMD: Yes; Sense: No; ComponentHeight: 2.65mm; HelpURL: \\cern.ch\dfs\Applications\Altium\Datasheets\SMBJ.pdf; Author: CERN DEM JLC; CreateDate: 10.04.2013; LatestRevisionDate: 10.04.2013
T_FL1 = FIL_MURATA_BNX022-01L: Block Type EMIFIL (LC Combined); Part Description: Block Type EMIFIL (LC Combined) SMD Type, BNX02* Series; Manufacturer: MURATA; Resistance: 0.5R; Part Number: FIL_MURATA_BNX022-01L; Component Kind: Standard; Component Type: Standard; Pin Count: 2; Value: 10A/50VDC; Status: None; Manufacturer Part Number: BNX022-01L; Mounted: Yes; Socket: No; SMD: Yes; Sense: No; ComponentHeight: 3.3mm; HelpURL: \\cern.ch\dfs\Applications\Altium\Datasheets\FIL_MURATA_BNX022-01L.pdf; Author: CERN DEM JLC; CreateDate: 10.10.2012; LatestRevisionDate: 10.10.2012
T_J6 = MOLEX_39-30-0040: Connector 4 Male; Part Description: 4.20mm (.165") Pitch Mini-Fit Jr. Header, Dual Row, Right Angle with Snap-in Plastic Peg PCB Lock, 4 Circuits; Manufacturer: MOLEX; PressFit: No; Part Number: MOLEX_39-30-0040; Component Kind: Standard; Component Type: Standard; Pin Count: 4; Family: Mini-Fit Jr.™; Mounted: Yes; Socket: No; SMD: No; Sense: No; Status: None; Manufacturer Part Number: 39-30-0040; ComponentHeight: 11.4mm; HelpURL: \\cern.ch\dfs\Applications\Altium\Datasheets\MOLEX_39-30-0040.pdf; Author: CERN DEM JLC; CreateDate: 2018-10-02; LatestRevisionDate: 2018-10-02

## Sheet Mechanical.SchDoc: =DocumentName
size A4; DocumentNumber: 1; Revision: 0; SheetNumber: 12; SheetTotal: 18
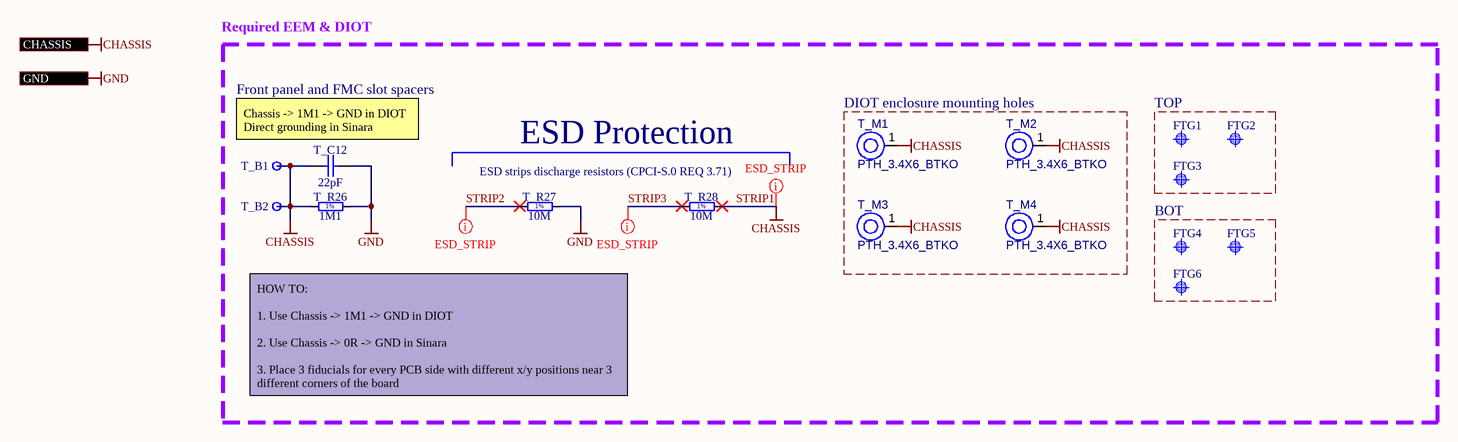
[diagram p11: Mechanical.SchDoc]

### Parts
FTG1  Use only in PCB  [FIDUCIAL_TOP_C100-200]  (value not drawn)
FTG2  Use only in PCB  [FIDUCIAL_TOP_S100-200]  (value not drawn)
FTG3  Use only in PCB  [FIDUCIAL_TOP_S100-200]  (value not drawn)
FTG4  Use only in PCB  [FIDUCIAL_TOP_C100-200]  (value not drawn)
FTG5  Use only in PCB  [FIDUCIAL_TOP_S100-200]  (value not drawn)
FTG6  Use only in PCB  [FIDUCIAL_TOP_S100-200]  (value not drawn)
T_B1  Plated Hole  [c600h270]  (value not drawn)  (no BOM)
T_B2  Plated Hole  [c600h270]  (value not drawn)  (no BOM)
T_C12  22pF  [CAPC1005X55N]
T_M1  PTH_3.4X6_BTKO  [PTH-M3.4x6.0_BTKO]  (no BOM)
T_M2  PTH_3.4X6_BTKO  [PTH-M3.4x6.0_BTKO]  (no BOM)
T_M3  PTH_3.4X6_BTKO  [PTH-M3.4x6.0_BTKO]  (no BOM)
T_M4  PTH_3.4X6_BTKO  [PTH-M3.4x6.0_BTKO]  (no BOM)
T_R26  1M1  [RESC2012X60N]
T_R27  10M  [RESC2113X55N]
T_R28  10M  [RESC2113X55N]

### Blocks framed on the sheet
ESD Protection: T_B1 T_B2 T_C12 T_R26-T_R28
DIOT enclosure mounting holes: T_M1-T_M4
TOP: FTG1-FTG3
BOT: FTG4-FTG6

### Ports
CHASSIS, GND

### Nets
CHASSIS: T_B1.1 T_B2.1 T_C12.1 T_M1.1(H1) T_M2.1(H1) T_M3.1(H1) T_M4.1(H1) T_R26.1 T_R28.2 ; port CHASSIS  [also labelled STRIP1]
GND: T_C12.2 T_R26.2 T_R27.2 ; port GND
STRIP2: T_R27.1
STRIP3: T_R28.1

### Layout directives
net class ESD_STRIP: CHASSIS, STRIP2, STRIP3

### Notes on the sheet
- Required EEM & DIOT
- Front panel and FMC slot spacers
- Chassis -> 1M1 -> GND in DIOT
  Direct grounding in Sinara
- ESD strips discharge resistors (CPCI-S.0 REQ 3.71)
- HOW TO:
  1. Use Chassis -> 1M1 -> GND in DIOT
  2. Use Chassis -> 0R -> GND in Sinara
  3. Place 3 fiducials for every PCB side with different x/y positions near 3 different corners of the board
- Release
- Last modified =ModifiedDate
  Sheet =sheetnumber of =sheettotal · Size A4
- Copyright =P_copyright_owner
  This source describes Open Hardware and is licensed under the CERN-OHL-W v2. You may redistribute and modify this source and make products using it under the terms of the CERN-OHL-W v2 (https://cern.ch/cern-ohl). This source is distributed WITHOUT ANY EXPRESS OR IMPLIED WARRANTY, INCLUDING OF MERCHANTABILITY, SATISFACTORY QUALITY AND FITNESS FOR A PARTICULAR PURPOSE. Please see the CERN-OHL-W v2 for applicable conditions.
  Notice: If You produce hardware based on this source, You must maintain the Source Location visible on the product, its packaging or its documentation.
- SINARA OPEN HARDWARE
- OPEN HARDWARE FOR SCIENTIFIC INSTRUMENTATION
- https://github.com/sinara-hw
- Release owner
- Designers
- Reviewers
- Source location:
- (in symbol R0805_1M1_1%_0.125W_100PPM) 1%
- (in symbol R0805_10M_1%_0.125W_100PPM_VISHAY_CRCW e3) 1%

### Library data of the parts
FTG1 FTG4 = FIDUCIAL_TARGET_C100-200: Fiducial Target; Part Description: Round Fiducial Target, Top Layer, 1.0mm, Top Solder 2.0mm, Keepout =2.0mm; Mounted: No; Part Number: FIDUCIAL_TARGET_C100-200; Component Kind: Standard (No BOM); Component Type: Standard (No BOM); Pin Count: 1; Family: Fiducial; Socket: No; SMD: Yes; Sense: No; Status: None; ComponentHeight: 0mm; HelpURL: Undefined; Author: CERN DEM JLC; CreateDate: 09.02.2010; LatestRevisionDate: 04.04.2012; PackageDescription: Round Fiducial Target, Top Layer, 1.0mm, Top Solder 2.0mm, Keepout =2.0mm
FTG2 FTG3 FTG5 FTG6 = FIDUCIAL_TARGET_S100-200: Fiducial Target; Part Description: Square Fiducial Target, Top Layer, 1.0mm, Top Solder 2.0mm, Keepout =2.0mm; Mounted: No; Part Number: FIDUCIAL_TARGET_S100-200; Component Kind: Standard (No BOM); Component Type: Standard (No BOM); Pin Count: 1; Family: Fiducial; Socket: No; SMD: Yes; Sense: No; Status: None; ComponentHeight: 0mm; HelpURL: Undefined; Author: CERN DEM JLC; CreateDate: 09.02.2010; LatestRevisionDate: 04.04.2012; PackageDescription: Square Fiducial Target, Top Layer, 1.0mm, Top Solder 2.0mm, Keepout =2.0mm
T_B1 T_B2 = PLATED_HOLE2.7_PAD6.0: Single Terminal Socket; Part Description: Plated Through Hole: Hole Dia.=2.7mm Pad Dia.=6.0mm; Mounted: No; Part Number: PLATED_HOLE2.7_PAD6.0; Component Type: Standard (No BOM); Pin Count: 1; Family: Plated Hole; Socket: No; SMD: No; Sense: No; Status: None; ComponentHeight: 0mm; HelpURL: Undefined; Author: CERN DEM HF; CreateDate: 28.08.2024; LatestRevisionDate: 28.08.2024; PackageDescription: Plated Through Hole: Hole Dia.=2.7mm Pad Dia.=6.0mm
T_C12 = CC0402_22PF_50V_5%_C0G: Non-polarised capacitor; Part Description: SMD Multilayer Chip Ceramic Capacitor; Manufacturer: GENERIC; Manufacturer1 Part Number: C0402C220J5GACTU; Voltage: 50V; TC: C0G/NP0; Tolerance: ±5%; Part Number: CC0402_22PF_50V_5%_C0G; Component Kind: Standard; Component Type: Standard; Pin Count: 2; Value: 22pF; Status: Preferred; Manufacturer Part Number: CC0402_22PF_50V_5%_C0G; Case: 0402; Mounted: Yes; Socket: No; SMD: Yes; Manufacturer1 Example: KEMET; Manufacturer1 ComponentHeight: 0.55mm; HelpURL: \\cern.ch\dfs\Applications\Altium\Datasheets\CC0402_C0G_KEMET_(Commercial Grade).pdf; Author: CERN DEM JLC; CreateDate: 2007-12-03; LatestRevisionDate: 2007-12-03; Sense: No
T_M1-T_M4 = CMP-00028-00019-2: PTH  Hole 3.4, 6mm pad; Pins: 1
T_R26 = R0805_1M1_1%_0.125W_100PPM: Resistor - 1%; Part Description: General Purpose Thick Film Chip Resistor; Manufacturer: GENERIC; Manufacturer1 Part Number: NRC10F1104TRF; PressFit: No; Part Number: R0805_1M1_1%_0.125W_100PPM; Component Kind: Standard; Component Type: Standard; Pin Count: 2; Value: 1M1; Status: Preferred; Manufacturer Part Number: R0805_1M1_1%_0.125W_100PPM; Case: 0805; Mounted: Yes; Sense: No; Socket: No; SMD: Yes; Manufacturer1 Example: NIC COMPONENT; Manufacturer1 ComponentHeight: 0.6mm; HelpURL: \\cern.ch\dfs\Applications\Altium\Datasheets\R0805_NIC_NRC.pdf; Author: CERN DEM JLC; CreateDate: 03/12/2007; LatestRevisionDate: 13/03/2008
T_R27 T_R28 = R0805_10M_1%_0.125W_100PPM_VISHAY_CRCW e3: Resistor - 1%; Part Description: 150V, Standard Thick Film Chip Resistor; Manufacturer: VISHAY DALE; Manufacturer Part Number: CRCW080510M0FKEA; Power: 0.125W; TC: ±100ppm/°C; PressFit: No; Part Number: R0805_10M_1%_0.125W_100PPM_VISHAY_CRCW e3; Component Kind: Standard; Component Type: Standard; Pin Count: 2; Value: 10M; Status: None; Tolerance: ±1%; Case: 0805; Mounted: Yes; Sense: No; Socket: No; SMD: Yes; ComponentHeight: 0.5mm; HelpURL: \\cern.ch\dfs\Applications\Altium\Datasheets\R0805_VISHAY_CRCW e3.pdf; Author: CERN DEM BC; CreateDate: 2019-11-12; LatestRevisionDate: 2019-11-12

## Sheet I2C_switch.SchDoc: =DocumentName
size A4; SPICEModelCacheVGBTAUBO: <root> / <DocumentId>VGBTAUBO</DocumentId> / </root>; DocumentNumber: 1; Revision: 0; SheetNumber: 13; SheetTotal: 18
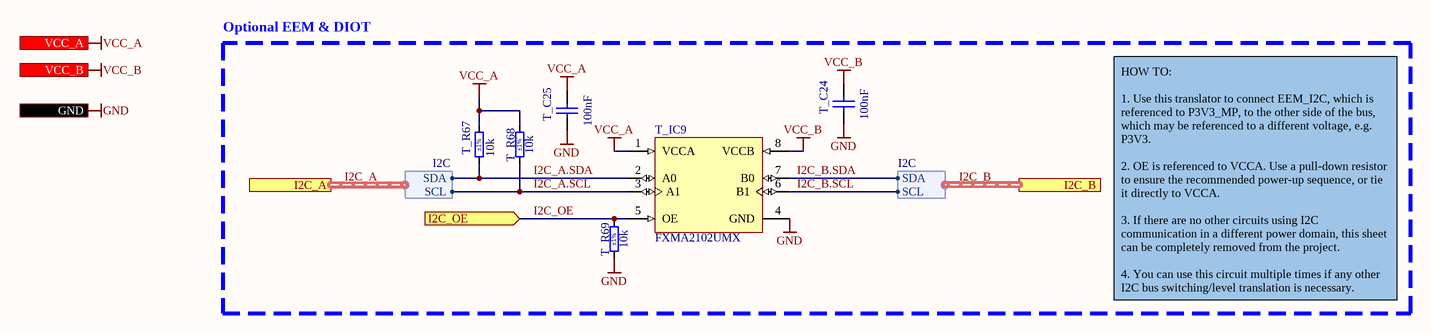
[diagram p12: I2C_switch.SchDoc]

### Parts
T_C24  100nF  [CAPC1005X55N]
T_C25  100nF  [CAPC1005X55N]
T_IC9  FXMA2102UMX  [FXMA2102UMX]
T_R67  10k  Tolerance: ±1%  [RESC1005X40N]
T_R68  10k  Tolerance: ±1%  [RESC1005X40N]
T_R69  10k  Tolerance: ±1%  [RESC1005X40N]

### Blocks framed on the sheet
Optional EEM & DIOT: T_C24 T_C25 T_IC9 T_R67-T_R69

### Ports
GND, I2C_A (harness I2C), I2C_B (harness I2C), I2C_OE (in), VCC_A (in), VCC_B (in)

### Harnesses
I2C: SDA, SCL

### Nets
GND: T_C24.1 T_C25.1 T_IC9.4(GND) T_R69.1 ; port GND
I2C_OE: T_C25.2 T_IC9.1(VCCA) T_IC9.5(OE) T_R67.2 T_R68.2 T_R69.2 ; port VCC_A, port I2C_OE  [also labelled VCC_A]  [project net P3V3]
VCC_B: T_C24.2 T_IC9.8(VCCB) ; port VCC_B  [project net P3V3_MP]
I2C_A.SCL: T_IC9.3(A1) T_R68.1 ; port I2C_A.SCL
I2C_A.SDA: T_IC9.2(A0) T_R67.1 ; port I2C_A.SDA
I2C_B.SCL: T_IC9.6(B1) ; port I2C_B.SCL  [project net EEM0_I2C.SCL]
I2C_B.SDA: T_IC9.7(B0) ; port I2C_B.SDA  [project net EEM0_I2C.SDA]

### Buses and harness runs
harness I2C_A = port I2C_A
harness I2C_B = port I2C_B

### Notes on the sheet
- HOW TO:
  1. Use this translator to connect EEM_I2C, which is referenced to P3V3_MP, to the other side of the bus, which may be referenced to a different voltage, e.g. P3V3.
  2. OE is referenced to VCCA. Use a pull-down resistor to ensure the recommended power-up sequence, or tie it directly to VCCA.
  3. If there are no other circuits using I2C communication in a different power domain, this sheet can be completely removed from the project.
  4. You can use this circuit multiple times if any other I2C bus switching/level translation is necessary.
- Release
- Last modified =ModifiedDate
  Sheet =sheetnumber of =sheettotal · Size A4
- Copyright =P_copyright_owner
  This source describes Open Hardware and is licensed under the CERN-OHL-W v2. You may redistribute and modify this source and make products using it under the terms of the CERN-OHL-W v2 (https://cern.ch/cern-ohl). This source is distributed WITHOUT ANY EXPRESS OR IMPLIED WARRANTY, INCLUDING OF MERCHANTABILITY, SATISFACTORY QUALITY AND FITNESS FOR A PARTICULAR PURPOSE. Please see the CERN-OHL-W v2 for applicable conditions.
  Notice: If You produce hardware based on this source, You must maintain the Source Location visible on the product, its packaging or its documentation.
- SINARA OPEN HARDWARE
- OPEN HARDWARE FOR SCIENTIFIC INSTRUMENTATION
- https://github.com/sinara-hw
- Release owner
- Designers
- Reviewers
- Source location:

### Library data of the parts
T_C24 T_C25 = CC0402_100NF_50V_10%_X7R: as T_C14 on sheet Power-up_delay; Part Number: CC0402_100NF_50V_10%_X7R; Component Kind: Standard; Component Type: Standard; Pin Count: 2; Value: 100nF; Status: None; Manufacturer Part Number: CC0402_100NF_50V_10%_X7R; Case: 0402; Mounted: Yes; Socket: No; SMD: Yes; Manufacturer1 Example: MURATA; Manufacturer1 ComponentHeight: 0.55mm; HelpURL: \\cern.ch\dfs\Applications\Altium\Datasheets\CC0402_MURATA_GRM155R71H104KE14D.pdf; Author: CERN DEM MR; CreateDate: 30.06.2017; LatestRevisionDate: 30.06.2017; Sense: No
T_IC9 = CMP-015-00014-1: as T_IC8 on sheet DIOT_signal_routing; Min Operating Temperature: -40°C; Pins: 8; Max Operating Temperature: 85°C; Manufacaturer Part Number: FXMA2102UMX; Mounting Technology: Surface Mount
T_R67-T_R69 = R0402_10K_1%_0.0625W_100PPM: Resistor - 1%; Part Description: General Purpose Thick Film Chip Resistor; Manufacturer: GENERIC; Manufacturer1 Part Number: 232270671003L; TC: ±100ppm/°C; PressFit: No; Part Number: R0402_10K_1%_0.0625W_100PPM; Component Kind: Standard; Component Type: Standard; Pin Count: 2; Value: 10k; Status: Not Recommended; Power: 0.0625W; Manufacturer Part Number: R0402_10K_1%_0.0625W_100PPM; Case: 0402; Mounted: Yes; Sense: No; Socket: No; SMD: Yes; Manufacturer1 Example: YAGEO PHYCOMP; Manufacturer1 ComponentHeight: 0.4mm; HelpURL: \\cern.ch\dfs\Applications\Altium\Datasheets\R0402_Phycomp_RC0402.pdf; Author: CERN DEM JLC; CreateDate: 03.12.2007; LatestRevisionDate: 17.10.2012

## Sheet FPGA.SchDoc: =DocumentName
size A4; DocumentNumber: 1; Revision: 0; SheetNumber: 14; SheetTotal: 18
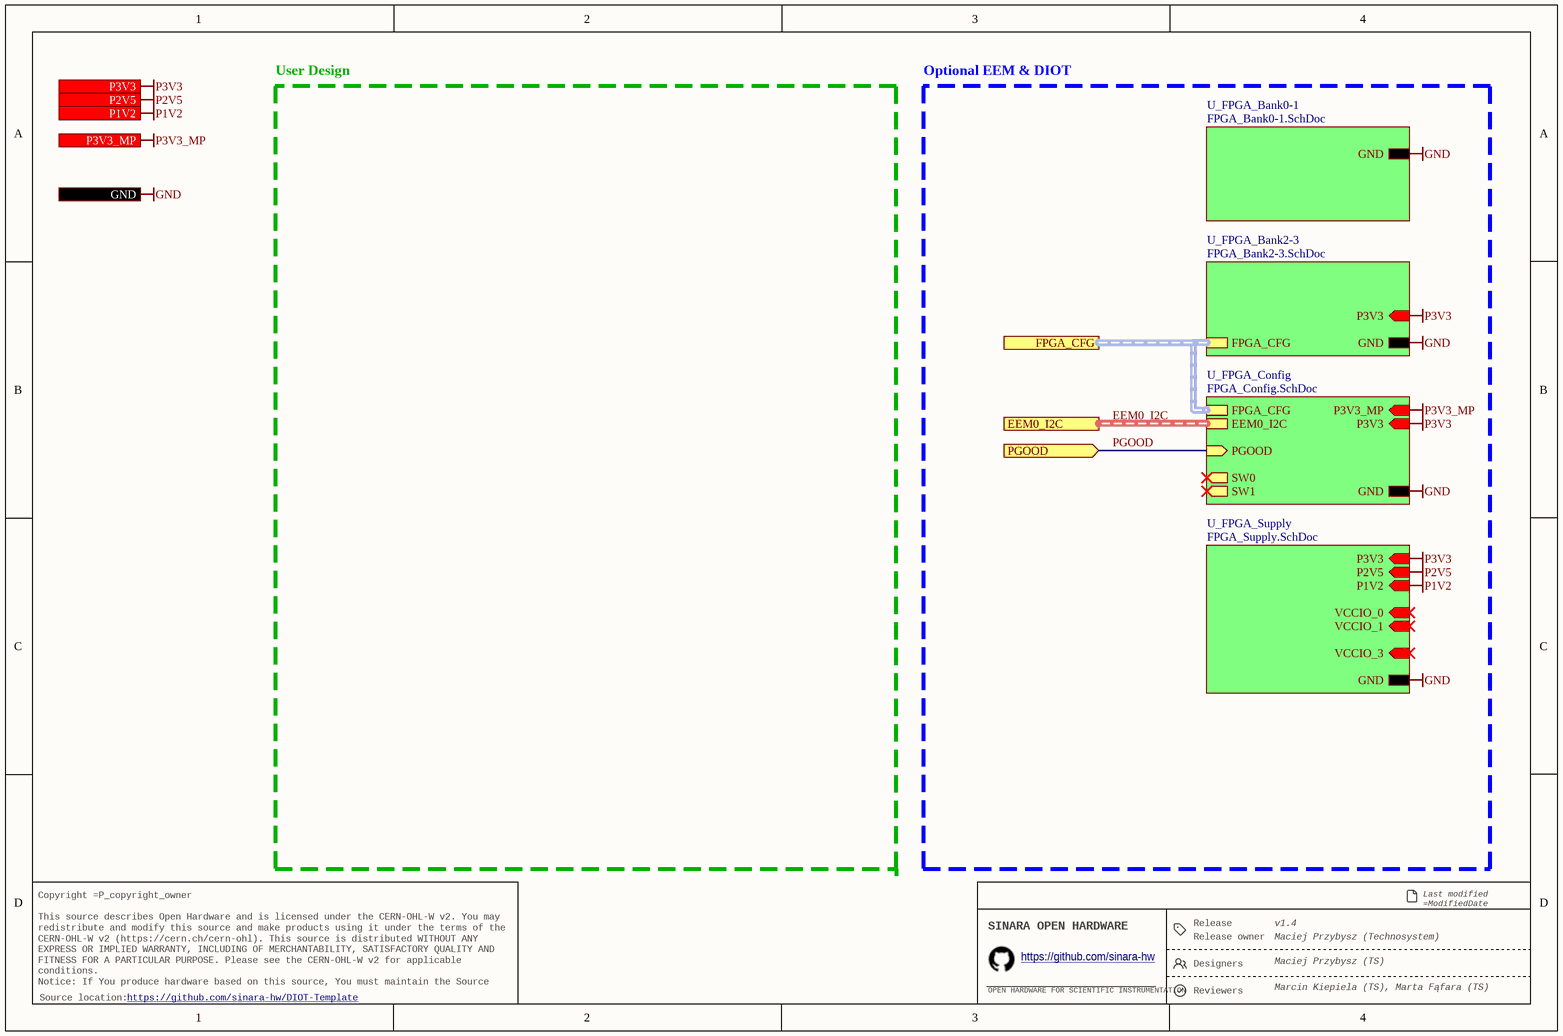
[diagram p13: FPGA.SchDoc]

### Sub-sheets
U_FPGA_Bank0-1 = FPGA_Bank0-1.SchDoc: GND
U_FPGA_Bank2-3 = FPGA_Bank2-3.SchDoc: GND, P3V3 (in), FPGA_CFG (harness FPGA_CFG)
U_FPGA_Config = FPGA_Config.SchDoc: FPGA_CFG (harness FPGA_CFG), EEM0_I2C (harness I2C), P3V3_MP (in), P3V3 (in), GND, PGOOD (in), SW0 (out), SW1 (out)
U_FPGA_Supply = FPGA_Supply.SchDoc: P3V3 (in), P1V2 (in), VCCIO_0 (in), P2V5 (in), VCCIO_1 (in), VCCIO_3 (in), GND

### Ports
EEM0_I2C (harness I2C), FPGA_CFG (harness FPGA_CFG), GND, P1V2 (in), P2V5 (in), P3V3 (in), P3V3_MP (in), PGOOD (in)

### Nets
GND: port GND, sheet U_FPGA_Bank0-1/GND, sheet U_FPGA_Bank2-3/GND, sheet U_FPGA_Supply/GND, sheet U_FPGA_Config/GND
P1V2: port P1V2, sheet U_FPGA_Supply/P1V2
P2V5: port P2V5, sheet U_FPGA_Supply/P2V5
P3V3: port P3V3, sheet U_FPGA_Bank2-3/P3V3, sheet U_FPGA_Supply/P3V3, sheet U_FPGA_Config/P3V3
P3V3_MP: port P3V3_MP, sheet U_FPGA_Config/P3V3_MP
PGOOD: port PGOOD, sheet U_FPGA_Config/PGOOD

### Buses and harness runs
harness EEM0_I2C = port EEM0_I2C = sheet U_FPGA_Config/EEM0_I2C
harness port FPGA_CFG = sheet U_FPGA_Bank2-3/FPGA_CFG = sheet U_FPGA_Config/FPGA_CFG

### Notes on the sheet
- User Design
- Optional EEM & DIOT
- VCCIO_2 = P3V3
- Release
- Last modified =ModifiedDate
  Sheet =sheetnumber of =sheettotal · Size A4
- Copyright =P_copyright_owner
  This source describes Open Hardware and is licensed under the CERN-OHL-W v2. You may redistribute and modify this source and make products using it under the terms of the CERN-OHL-W v2 (https://cern.ch/cern-ohl). This source is distributed WITHOUT ANY EXPRESS OR IMPLIED WARRANTY, INCLUDING OF MERCHANTABILITY, SATISFACTORY QUALITY AND FITNESS FOR A PARTICULAR PURPOSE. Please see the CERN-OHL-W v2 for applicable conditions.
  Notice: If You produce hardware based on this source, You must maintain the Source Location visible on the product, its packaging or its documentation.
- SINARA OPEN HARDWARE
- OPEN HARDWARE FOR SCIENTIFIC INSTRUMENTATION
- https://github.com/sinara-hw
- Release owner
- Designers
- Reviewers
- Source location:

## Sheet FPGA_Bank0-1.SchDoc: =DocumentName
size A3; DocumentNumber: 1; Revision: 0; SheetNumber: 15; SheetTotal: 18
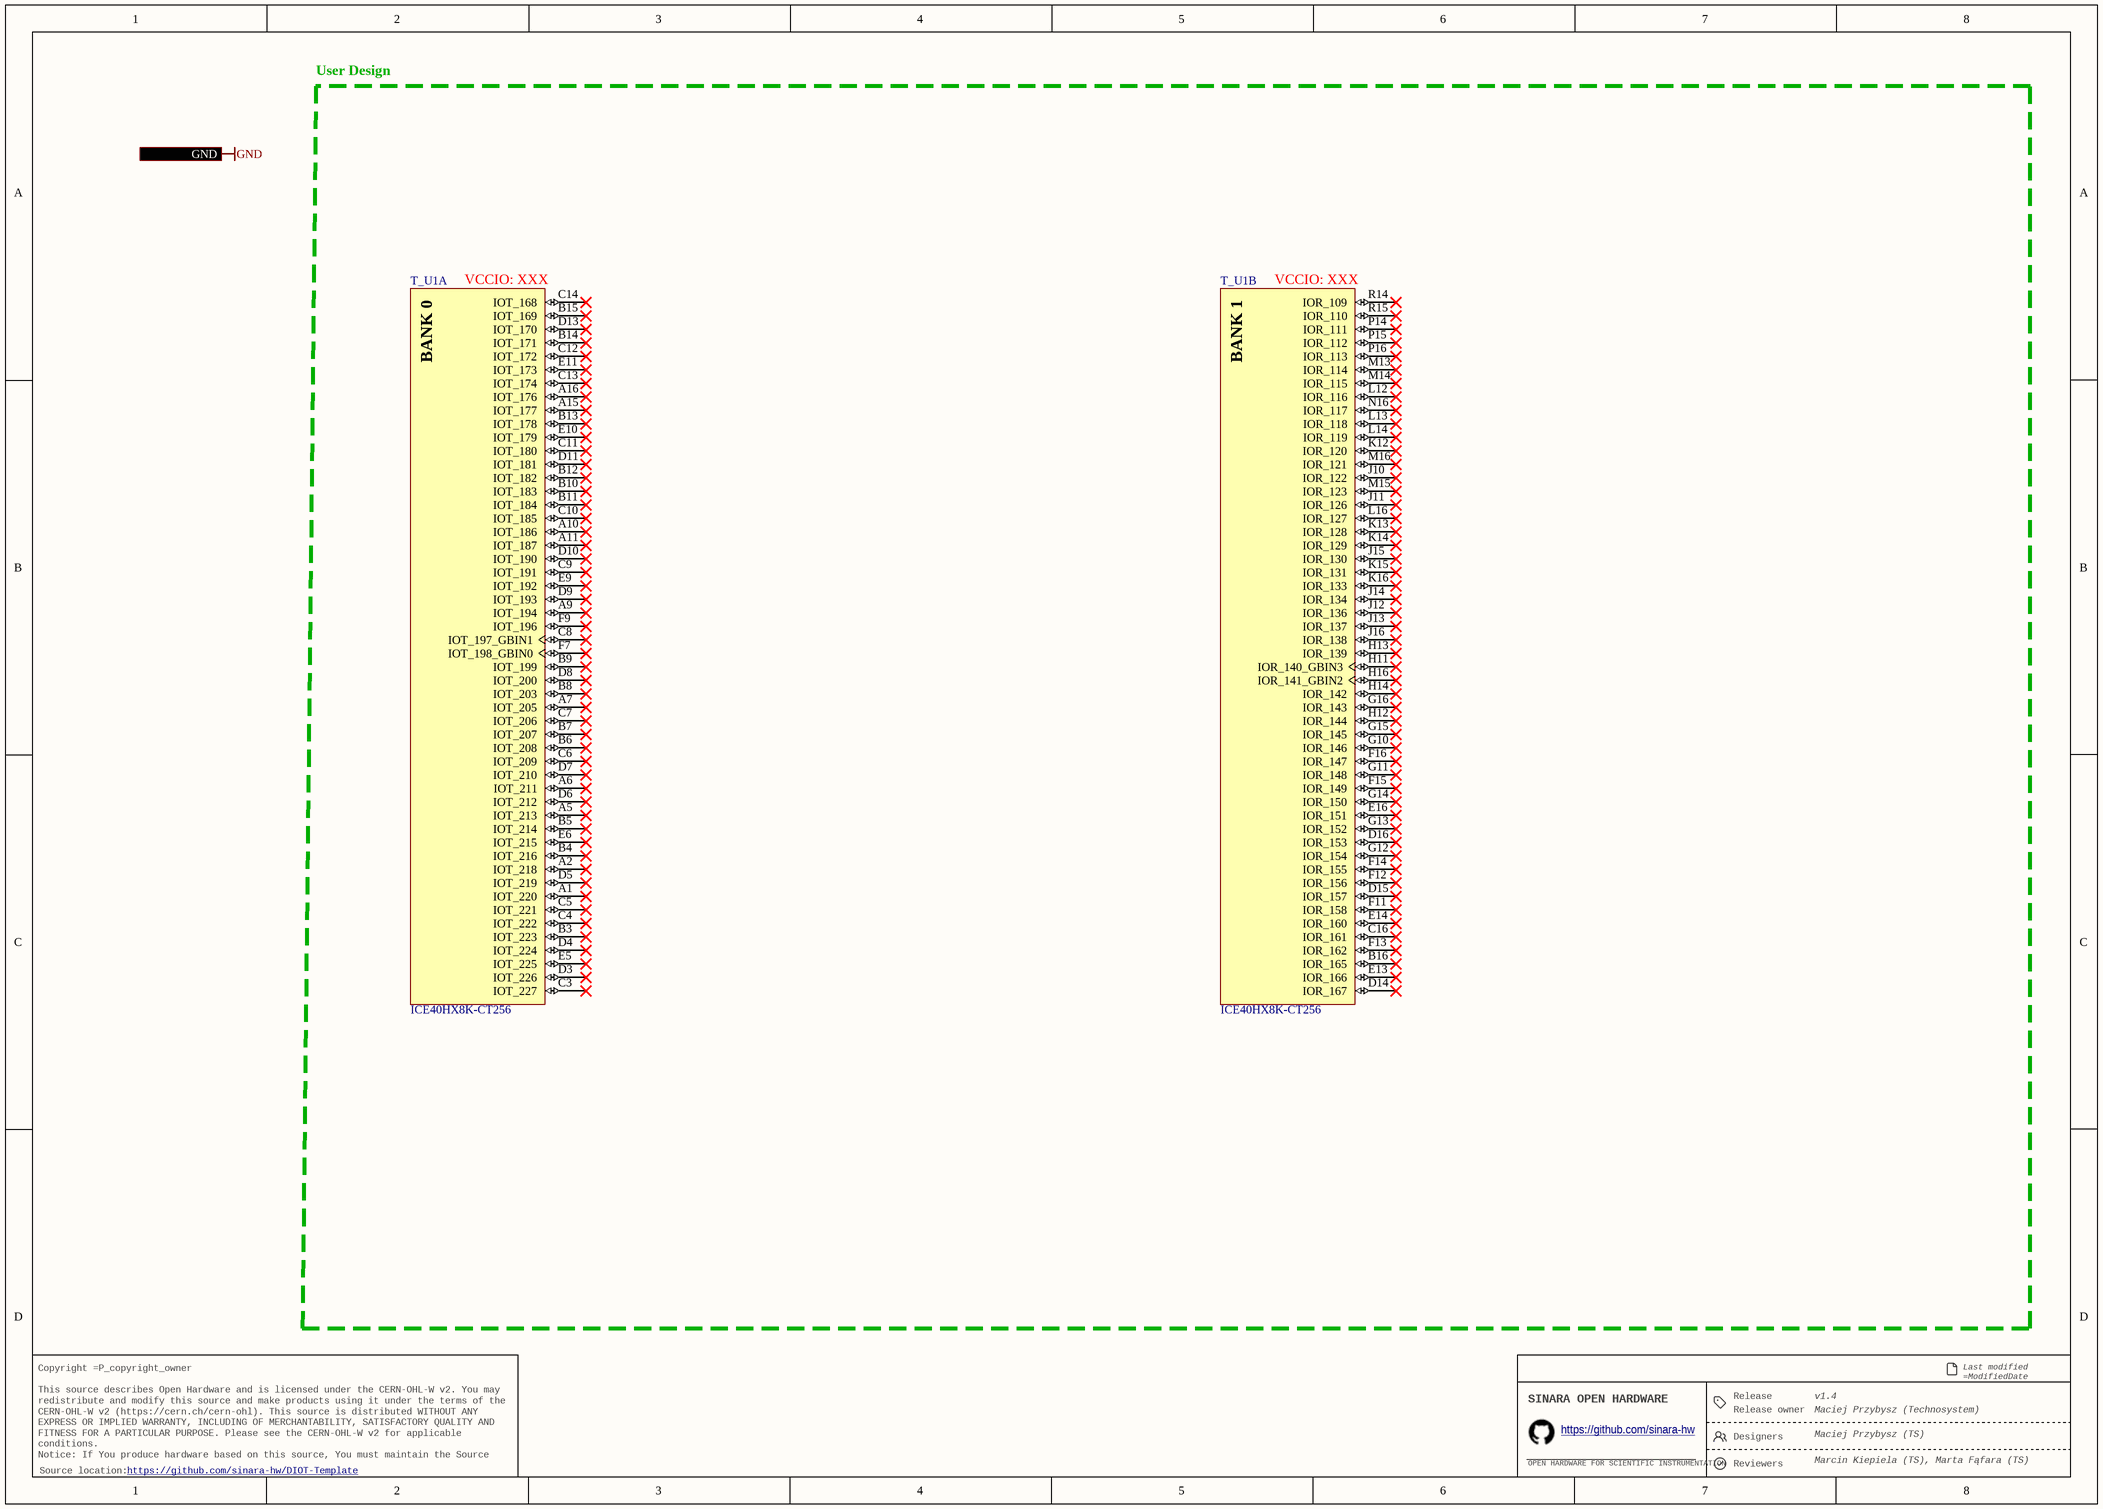
[diagram p14: FPGA_Bank0-1.SchDoc]

### Parts
T_U1  ICE40HX8K-CT256  [LATC-caBGA-256]  (parts A,B of 5)

### Ports
GND

### Nets

Not connected (* = marked no-connect by the designer): T_U1 A1(IOT_220)* A2(IOT_218)* A5(IOT_213)* A6(IOT_211)* A7(IOT_205)* A9(IOT_194)* A10(IOT_186)* A11(IOT_187)* A15(IOT_177)* A16(IOT_176)* B3(IOT_223)* B4(IOT_216)* B5(IOT_214)* B6(IOT_208)* B7(IOT_207)* B8(IOT_203)* B9(IOT_199)* B10(IOT_183)* B11(IOT_184)* B12(IOT_182)* B13(IOT_178)* B14(IOT_171)* B15(IOT_169)* B16(IOR_165)* C3(IOT_227)* C4(IOT_222)* C5(IOT_221)* C6(IOT_209)* C7(IOT_206)* C8(IOT_197_GBIN1)* C9(IOT_191)* C10(IOT_185)* C11(IOT_180)* C12(IOT_172)* C13(IOT_174)* C14(IOT_168)* C16(IOR_161)* D3(IOT_226)* D4(IOT_224)* D5(IOT_219)* D6(IOT_212)* D7(IOT_210)* D8(IOT_200)* D9(IOT_193)* D10(IOT_190)* D11(IOT_181)* D13(IOT_170)* D14(IOR_167)* D15(IOR_157)* D16(IOR_153)* E5(IOT_225)* E6(IOT_215)* E9(IOT_192)* E10(IOT_179)* E11(IOT_173)* E13(IOR_166)* E14(IOR_160)* E16(IOR_151)* F7(IOT_198_GBIN0)* F9(IOT_196)* F11(IOR_158)* F12(IOR_156)* F13(IOR_162)* F14(IOR_155)* F15(IOR_149)* F16(IOR_147)* G10(IOR_146)* G11(IOR_148)* G12(IOR_154)* G13(IOR_152)* G14(IOR_150)* G15(IOR_145)* G16(IOR_143)* H11(IOR_140_GBIN3)* H12(IOR_144)* H13(IOR_139)* H14(IOR_142)* H16(IOR_141_GBIN2)* J10(IOR_122)* J11(IOR_126)* J12(IOR_136)* J13(IOR_137)* J14(IOR_134)* J15(IOR_130)* J16(IOR_138)* K12(IOR_120)* K13(IOR_128)* K14(IOR_129)* K15(IOR_131)* K16(IOR_133)* L12(IOR_116)* L13(IOR_118)* L14(IOR_119)* L16(IOR_127)* M13(IOR_114)* M14(IOR_115)* M15(IOR_123)* M16(IOR_121)* N16(IOR_117)* P14(IOR_111)* P15(IOR_112)* P16(IOR_113)* R14(IOR_109)* R15(IOR_110)*

### Notes on the sheet
- User Design
- (near T_U1) VCCIO: XXX
- Release
- Last modified =ModifiedDate
  Sheet =sheetnumber of =sheettotal · Size A3
- Copyright =P_copyright_owner
  This source describes Open Hardware and is licensed under the CERN-OHL-W v2. You may redistribute and modify this source and make products using it under the terms of the CERN-OHL-W v2 (https://cern.ch/cern-ohl). This source is distributed WITHOUT ANY EXPRESS OR IMPLIED WARRANTY, INCLUDING OF MERCHANTABILITY, SATISFACTORY QUALITY AND FITNESS FOR A PARTICULAR PURPOSE. Please see the CERN-OHL-W v2 for applicable conditions.
  Notice: If You produce hardware based on this source, You must maintain the Source Location visible on the product, its packaging or its documentation.
- SINARA OPEN HARDWARE
- OPEN HARDWARE FOR SCIENTIFIC INSTRUMENTATION
- https://github.com/sinara-hw
- Release owner
- Designers
- Reviewers
- Source location:
- (in symbol CMP-0962-00001-1, part A) BANK 0
- (in symbol CMP-0962-00001-1, part B) BANK 1

### Library data of the parts
T_U1 = CMP-0962-00001-1: iCE40 HX8K Series FPGA Family, 7680 Logic Cells, 1.2 V Core, 128 K Embedded RAM Bits, 256-ball caBGA, Pb-Free, Tray; Manufacturer: Lattice Semiconductor; Supply Voltage: 1.2V; Phase-Locked Loops: 2; Logic Cells: 7680; Embedded RAM Bits: 128K; PackageReference: caBGA-256; PackageDescription: 256-Ball Chip Array Ball Grid Array, Body 14 x 14 mm, Pitch 0.8 mm; RoHS: TRUE; Packing: Tray; Mounting Technology: Surface Mount; ComponentLink3URL: http://www.latticesemi.com/lit/docs/package/pkg.pdf; ComponentLink1Description: Manufacturer URL; ComponentLink3Description: Package Specification; Code_JEDEC: MO-275; PackageVersion: Rev. 03.9, 02/2013; ComponentLink1URL: http://www.latticesemi.com/en; ComponentLink2URL: http://www.latticesemi.com/~/media/Documents/DataSheets/iCE/iCE40LPHXFamilyDataSheet.pdf; Manufacturer Part Number: ICE40HX8K-CT256; ComponentLink2Description: Datasheet; DatasheetVersion: Rev. 02.9

## Sheet FPGA_Bank2-3.SchDoc: =DocumentName
size A3; DocumentNumber: 1; Revision: 0; SheetNumber: 16; SheetTotal: 18
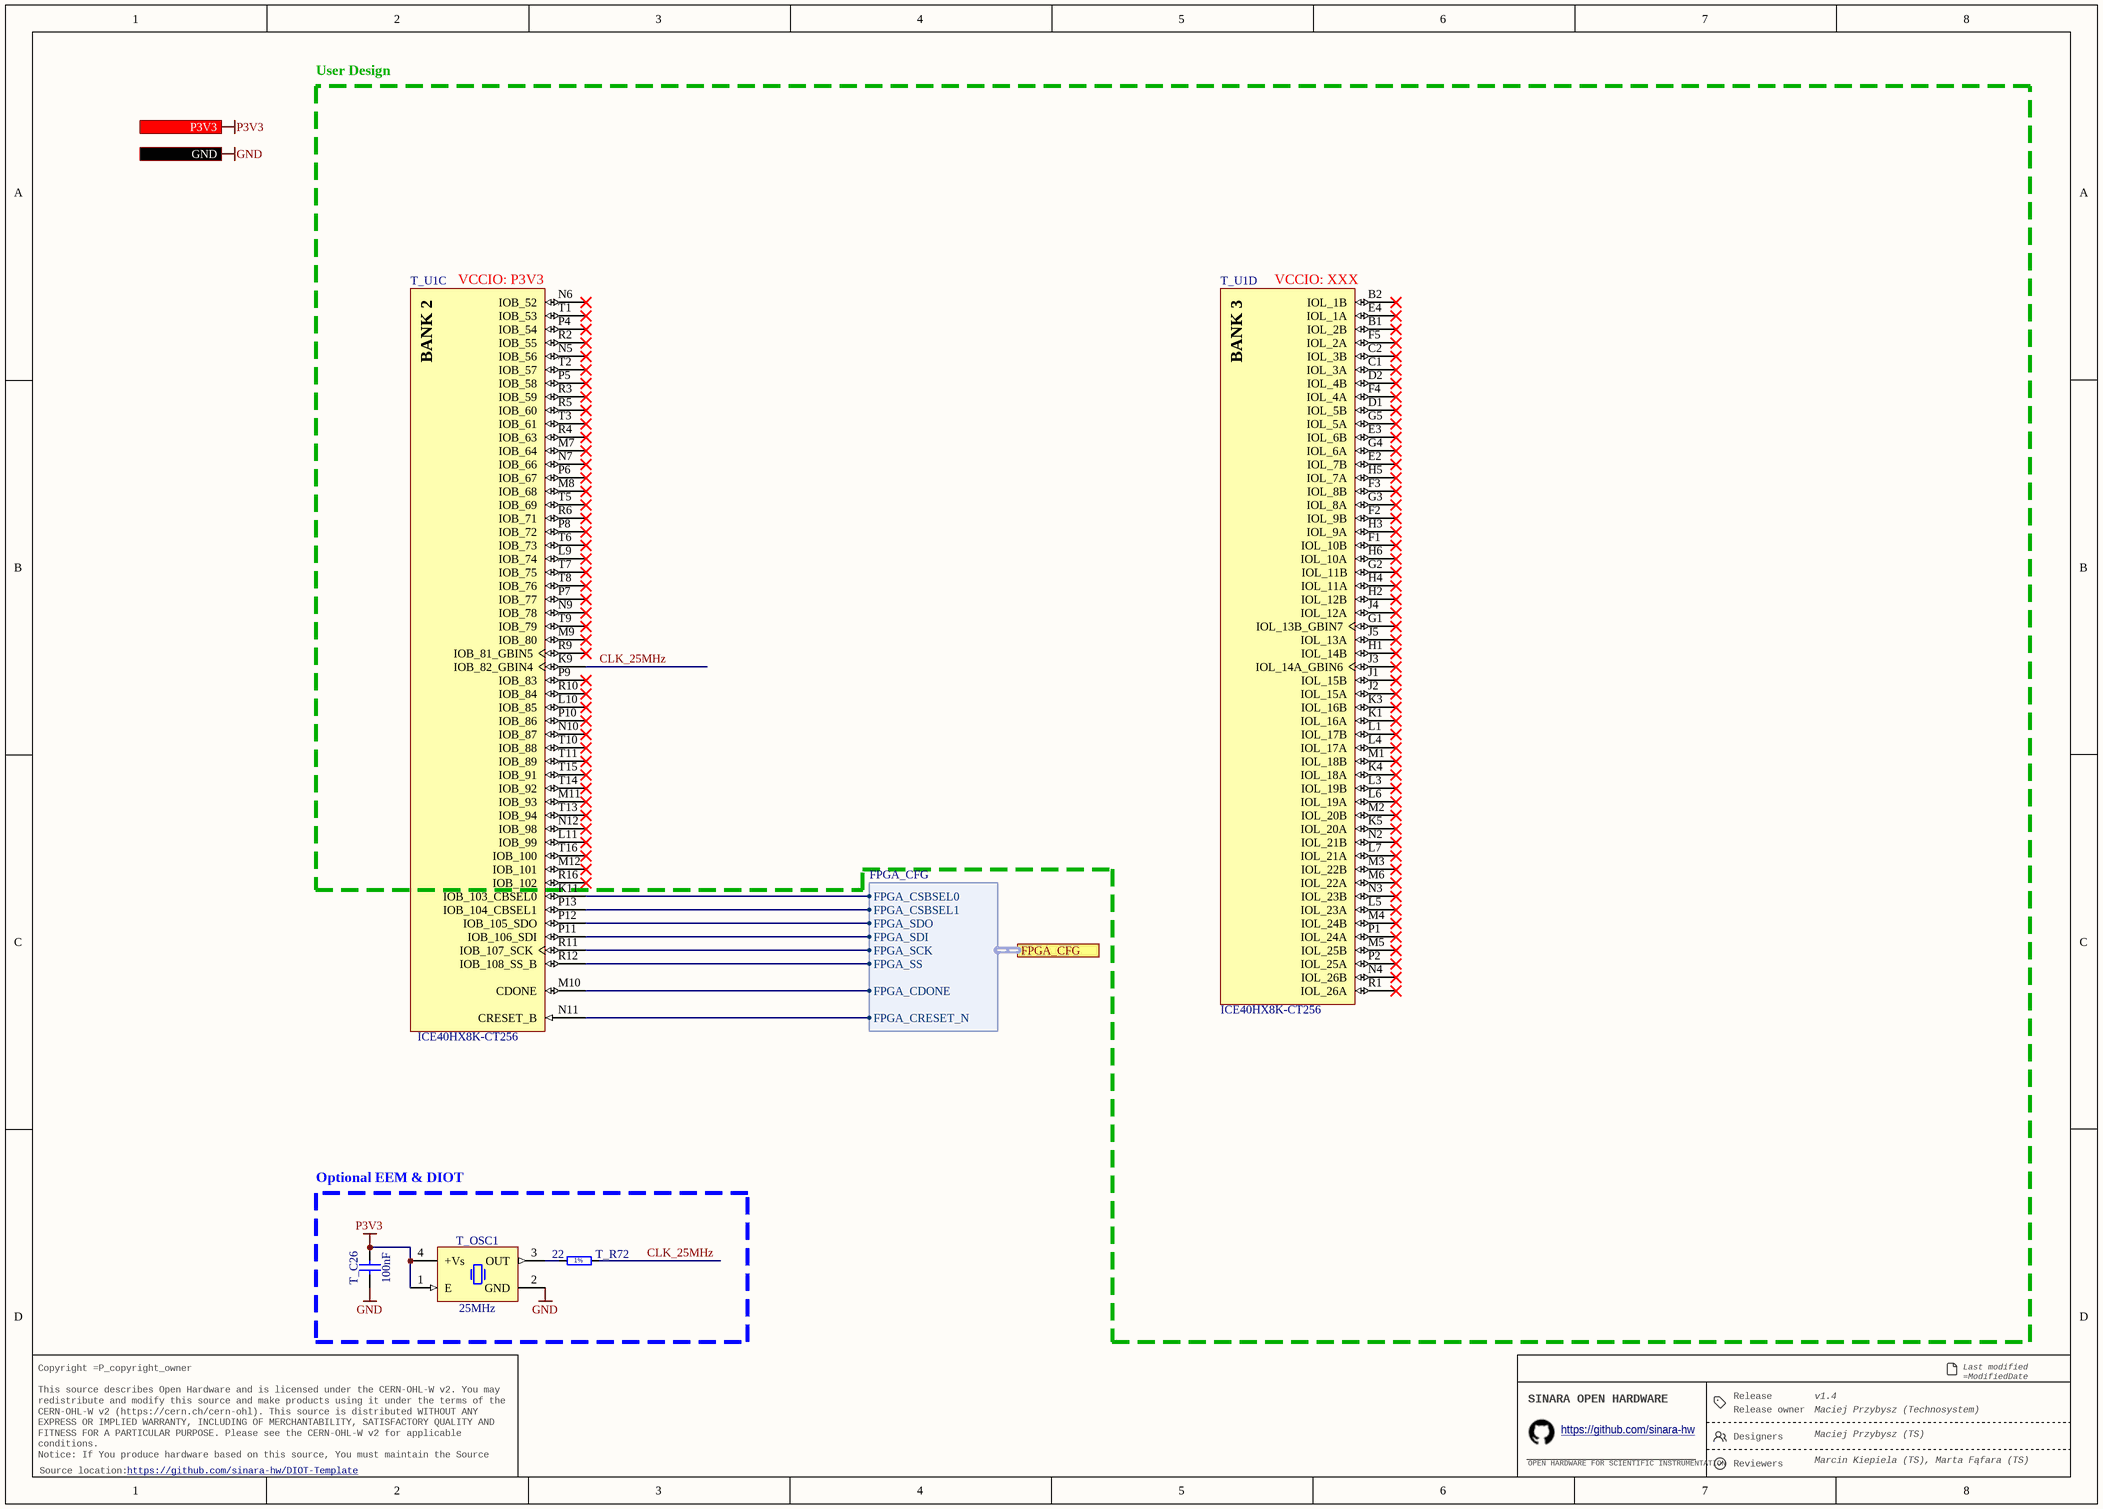
[diagram p15: FPGA_Bank2-3.SchDoc]

### Parts
T_C26  100nF  [CAPC1005X55N]
T_OSC1  25MHz  [OSC_IQD_CFPS-39]
T_R72  22  [RESC1005X40N]
T_U1  ICE40HX8K-CT256  [LATC-caBGA-256]  (parts C,D of 5)

### Blocks framed on the sheet
Optional EEM & DIOT: T_C26 T_OSC1 T_R72

### Ports
FPGA_CFG (harness FPGA_CFG), GND, P3V3 (in)

### Harnesses
FPGA_CFG: FPGA_CSBSEL0, FPGA_CSBSEL1, FPGA_SDO, FPGA_SDI, FPGA_SCK, FPGA_SS, FPGA_CDONE, FPGA_CRESET_N

### Nets
GND: T_C26.1 T_OSC1.2(GND) ; port GND
P3V3: T_C26.2 T_OSC1.1(E) T_OSC1.4(+Vs) ; port P3V3
CLK_25MHz: T_R72.2 T_U1.K9(IOB_82_GBIN4)
FPGA_CFG.FPGA_CDONE: T_U1.M10(CDONE) ; port FPGA_CFG.FPGA_CDONE
FPGA_CFG.FPGA_CRESET_N: T_U1.N11(CRESET_B) ; port FPGA_CFG.FPGA_CRESET_N
FPGA_CFG.FPGA_CSBSEL0: T_U1.K11(IOB_103_CBSEL0) ; port FPGA_CFG.FPGA_CSBSEL0
FPGA_CFG.FPGA_CSBSEL1: T_U1.P13(IOB_104_CBSEL1) ; port FPGA_CFG.FPGA_CSBSEL1
FPGA_CFG.FPGA_SCK: T_U1.R11(IOB_107_SCK) ; port FPGA_CFG.FPGA_SCK
FPGA_CFG.FPGA_SDI: T_U1.P11(IOB_106_SDI) ; port FPGA_CFG.FPGA_SDI
FPGA_CFG.FPGA_SDO: T_U1.P12(IOB_105_SDO) ; port FPGA_CFG.FPGA_SDO
FPGA_CFG.FPGA_SS: T_U1.R12(IOB_108_SS_B) ; port FPGA_CFG.FPGA_SS
NetT_OSC1_3: T_OSC1.3(OUT) T_R72.1

Not connected (* = marked no-connect by the designer): T_U1 B1(IOL_2B)* B2(IOL_1B)* C1(IOL_3A)* C2(IOL_3B)* D1(IOL_5B)* D2(IOL_4B)* E2(IOL_7B)* E3(IOL_6B)* E4(IOL_1A)* F1(IOL_10B)* F2(IOL_9B)* F3(IOL_8B)* F4(IOL_4A)* F5(IOL_2A)* G1(IOL_13B_GBIN7)* G2(IOL_11B)* G3(IOL_8A)* G4(IOL_6A)* G5(IOL_5A)* H1(IOL_14B)* H2(IOL_12B)* H3(IOL_9A)* H4(IOL_11A)* H5(IOL_7A)* H6(IOL_10A)* J1(IOL_15B)* J2(IOL_15A)* J3(IOL_14A_GBIN6)* J4(IOL_12A)* J5(IOL_13A)* K1(IOL_16A)* K3(IOL_16B)* K4(IOL_18A)* K5(IOL_20A)* L1(IOL_17B)* L3(IOL_19B)* L4(IOL_17A)* L5(IOL_23A)* L6(IOL_19A)* L7(IOL_21A)* L9(IOB_74)* L10(IOB_85)* L11(IOB_99)* M1(IOL_18B)* M2(IOL_20B)* M3(IOL_22B)* M4(IOL_24B)* M5(IOL_25B)* M6(IOL_22A)* M7(IOB_64)* M8(IOB_68)* M9(IOB_80)* M11(IOB_93)* M12(IOB_101)* N2(IOL_21B)* N3(IOL_23B)* N4(IOL_26B)* N5(IOB_56)* N6(IOB_52)* N7(IOB_66)* N9(IOB_78)* N10(IOB_87)* N12(IOB_98)* P1(IOL_24A)* P2(IOL_25A)* P4(IOB_54)* P5(IOB_58)* P6(IOB_67)* P7(IOB_77)* P8(IOB_72)* P9(IOB_83)* P10(IOB_86)* R1(IOL_26A)* R2(IOB_55)* R3(IOB_59)* R4(IOB_63)* R5(IOB_60)* R6(IOB_71)* R9(IOB_81_GBIN5)* R10(IOB_84)* R16(IOB_102)* T1(IOB_53)* T2(IOB_57)* T3(IOB_61)* T5(IOB_69)* T6(IOB_73)* T7(IOB_75)* T8(IOB_76)* T9(IOB_79)* T10(IOB_88)* T11(IOB_89)* T13(IOB_94)* T14(IOB_92)* T15(IOB_91)* T16(IOB_100)*

### Notes on the sheet
- User Design
- (near T_U1) VCCIO: P3V3
- (near T_U1) VCCIO: XXX
- Release
- Last modified =ModifiedDate
  Sheet =sheetnumber of =sheettotal · Size A3
- Copyright =P_copyright_owner
  This source describes Open Hardware and is licensed under the CERN-OHL-W v2. You may redistribute and modify this source and make products using it under the terms of the CERN-OHL-W v2 (https://cern.ch/cern-ohl). This source is distributed WITHOUT ANY EXPRESS OR IMPLIED WARRANTY, INCLUDING OF MERCHANTABILITY, SATISFACTORY QUALITY AND FITNESS FOR A PARTICULAR PURPOSE. Please see the CERN-OHL-W v2 for applicable conditions.
  Notice: If You produce hardware based on this source, You must maintain the Source Location visible on the product, its packaging or its documentation.
- SINARA OPEN HARDWARE
- OPEN HARDWARE FOR SCIENTIFIC INSTRUMENTATION
- https://github.com/sinara-hw
- Release owner
- Designers
- Reviewers
- Source location:
- (in symbol CMP-0962-00001-1, part C) BANK 2
- (in symbol CMP-0962-00001-1, part D) BANK 3
- (in symbol R0402_22R_1%_0.0625W_100PPM) 1%

### Library data of the parts
T_C26 = CC0402_100NF_50V_10%_X7R: Non-polarised capacitor; Part Description: SMD Multilayer Chip Ceramic Capacitor; Manufacturer: GENERIC; Manufacturer1 Part Number: GRM155R71H104KE14D; Voltage: 50V; TC: X7R; Tolerance: ±10%; Part Number: CC0402_100NF_50V_10%_X7R; Component Kind: Standard; Component Type: Standard; Pin Count: 2; Value: 100nF; Status: None; Manufacturer Part Number: CC0402_100NF_50V_10%_X7R; Case: 0402; Mounted: Yes; Socket: No; SMD: Yes; Sense: No; Manufacturer1 Example: MURATA; Manufacturer1 ComponentHeight: 0.55mm; HelpURL: \\cern.ch\dfs\Applications\Altium\Datasheets\CC0402_MURATA_GRM155R71H104KE14D.pdf; Author: CERN DEM MR; CreateDate: 30.06.2017; LatestRevisionDate: 30.06.2017
T_OSC1 = OSC_25MHZ_IQD_LFSPXO025165: Oscillator 4 pins 1=E 2=GND 3=OUT 4=+Vs; Part Description: 3.3V, ±50ppm, 15pF, -40 to 85°C, CMOS Surface Mount Clock Oscillator (CFPS-39 Series); Manufacturer: IQD FREQUENCY PRODUCTS; PressFit: No; Bonding: No; Part Number: OSC_25MHZ_IQD_LFSPXO025165; Component Kind: Standard; Component Type: Standard; PackageDescription: Oscillator, Corner Concave, 2.20mm Pitch, 4 Pins, 2.70mm L X 3.40mm W X 1.20mm H, CFPS-39 Series; Value: 25MHz; Manufacturer Part Number: LFSPXO025165; Pin Count: 4; Mounted: Yes; Socket: No; SMD: Yes; Sense: No; ComponentHeight: 1.2mm; HelpURL: \\cern.ch\dfs\Applications\Altium\Datasheets\OSC_IQD_LFSPXO025165.pdf; Author: CERN DEM JLC; CreateDate: 02.12.2010; LatestRevisionDate: 03.11.2016
T_R72 = R0402_22R_1%_0.0625W_100PPM: Resistor - 1%; Part Description: General Purpose Thick Film Chip Resistor; Manufacturer: GENERIC; Manufacturer1 Part Number: 232270672209L; TC: ±100ppm/°C; PressFit: No; Part Number: R0402_22R_1%_0.0625W_100PPM; Component Kind: Standard; Component Type: Standard; Pin Count: 2; Value: 22; Status: Not Recommended; Power: 0.0625W; Tolerance: ±1%; Manufacturer Part Number: R0402_22R_1%_0.0625W_100PPM; Case: 0402; Mounted: Yes; Sense: No; Socket: No; SMD: Yes; Manufacturer1 Example: YAGEO PHYCOMP; Manufacturer1 ComponentHeight: 0.4mm; HelpURL: \\cern.ch\dfs\Applications\Altium\Datasheets\R0402_Phycomp_RC0402.pdf; Author: CERN DEM JLC; CreateDate: 03/12/2007; LatestRevisionDate: 17/10/2012
T_U1 = CMP-0962-00001-1: as T_U1 on sheet FPGA_Bank0-1; PackageReference: caBGA-256; PackageDescription: 256-Ball Chip Array Ball Grid Array, Body 14 x 14 mm, Pitch 0.8 mm; RoHS: TRUE; Packing: Tray; Mounting Technology: Surface Mount; ComponentLink3URL: http://www.latticesemi.com/lit/docs/package/pkg.pdf; ComponentLink1Description: Manufacturer URL; ComponentLink3Description: Package Specification; Code_JEDEC: MO-275; PackageVersion: Rev. 03.9, 02/2013; ComponentLink1URL: http://www.latticesemi.com/en; ComponentLink2URL: http://www.latticesemi.com/~/media/Documents/DataSheets/iCE/iCE40LPHXFamilyDataSheet.pdf; Manufacturer Part Number: ICE40HX8K-CT256; ComponentLink2Description: Datasheet; DatasheetVersion: Rev. 02.9